# Altium project UWB-IQ-Mixer.PrjPcb
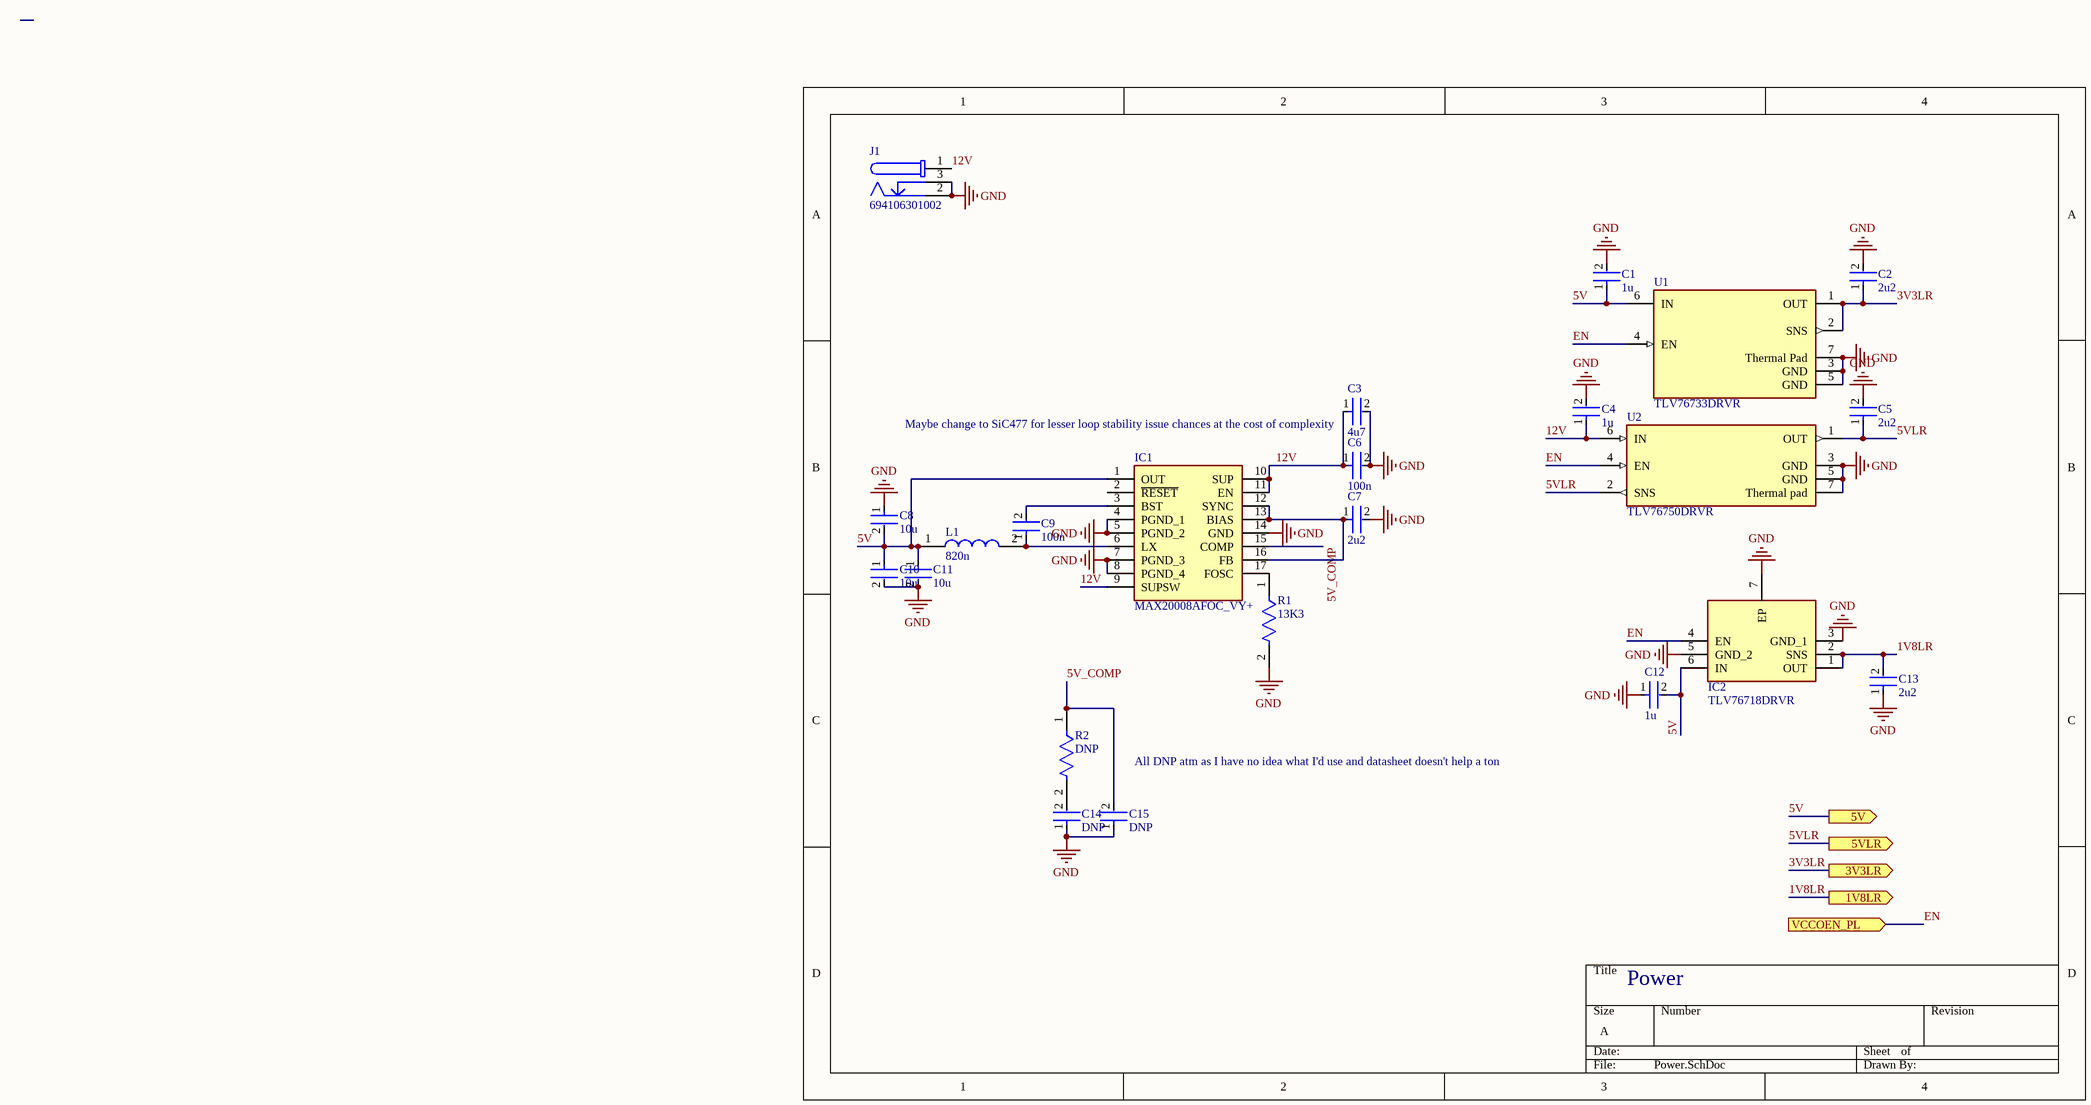
[diagram p0: Power.SchDoc]
9 sheets, 131 parts. Net scope: flat (ports and power ports of the same name join across sheets).
Board file: PCB.PcbDoc
Sheets:
  Power.SchDoc
  Mixers.SchDoc
  DACs.SchDoc
  PLL1.SchDoc
  PLL2.SchDoc
  SOM_AB.SchDoc
  SOM_CD.SchDoc
  Clock_Source.SchDoc
  Connectors.SchDoc

## Sheet Power.SchDoc
size A; SheetNumber: 1; SheetTotal: 9

### Parts
C1  1u  [FP-GRM155-0_1-MFG]
C2  2u2  [FP-GRM155-0_2-MFG]
C3  4u7  [FP-GRT188-0_2-IPC_A]
C4  1u  [FP-GRM155-0_1-MFG]
C5  2u2  [FP-GRM155-0_2-MFG]
C6  100n  [FP-GRM155-0_05-IPC_C]
C7  2u2  [FP-GRM155-0_2-MFG]
C8  10u  [FP-GRM188-0_2-IPC_B]
C9  100n  [FP-GRM155-0_05-IPC_C]
C10  10u  [FP-GRM188-0_2-IPC_B]
C11  10u  [FP-GRM188-0_2-IPC_B]
C12  1u  [FP-GRM155-0_1-MFG]
C13  2u2  [FP-GRM155-0_2-MFG]
C14  DNP  [FP-GRM155-0_05-IPC_C]  (no BOM)
C15  DNP  [FP-GRM155-0_05-IPC_C]  (no BOM)
IC1  MAX20008AFOC_VY+  [MAX20008AFOCVY]
IC2  TLV76718DRVR  [SON65P200X200X80-7N]
J1  694106301002  [694106301002]
L1  820n  [INDPM7166X300N]
R1  13K3  [FP-AC0402-IPC_B]
R2  DNP  [FP-AC0402-IPC_B]  (no BOM)
U1  TLV76733DRVR  [FP-DRV0006A-IPC_C]
U2  TLV76750DRVR  [FP-DRV0006A-IPC_B]

### Ports
1V8LR (out), 3V3LR (out), 5V (out), 5VLR (out), VCCOEN_PL (in)

### Nets
GND: C1.2 C2.2 C3.2 C4.2 C5.2 C6.2 C7.2 C8.1 C10.2 C11.2 C12.1 C13.1 C14.1 C15.1 IC1.4(PGND_1) IC1.5(PGND_2) IC1.7(PGND_3) IC1.8(PGND_4) IC1.14(GND) IC2.3(GND_1) IC2.5(GND_2) IC2.7(EP) J1.2 J1.3 R1.2 U1.3(GND) U1.5(GND) U1.7(Thermal_Pad) U2.3(GND) U2.5(GND) U2.7(Thermal_pad)  [project net PS0]
1V8LR: C13.2 IC2.1(OUT) IC2.2(SNS) ; port 1V8LR  [project net 1V8]
3V3LR: C2.1 U1.1(OUT) U1.2(SNS) ; port 3V3LR  [project net 3V3]
5V: C1.1 C8.2 C10.1 C11.1 C12.2 IC1.1(OUT) IC2.6(IN) L1.1 U1.6(IN) ; port 5V
5V_COMP: C15.2 IC1.15(COMP) R2.1
5VLR: C5.1 U2.1(OUT) U2.2(SNS) ; port 5VLR
12V: C3.1 C4.1 C6.1 IC1.9(SUPSW) IC1.10(SUP) IC1.11(EN) J1.1 U2.6(IN)
EN: IC2.4(EN) U1.4(EN) U2.4(EN) ; port VCCOEN_PL
NetC7_1: C7.1 IC1.12(SYNC) IC1.13(BIAS) IC1.16(FB)
NetC9_1: C9.1 IC1.6(LX) L1.2
NetC9_2: C9.2 IC1.3(BST)
NetC14_2: C14.2 R2.2
NetIC1_17: IC1.17(FOSC) R1.1

Not connected (* = marked no-connect by the designer): IC1 2(~{RESET})

### Notes on the sheet
- (near C3) Maybe change to SiC477 for lesser loop stability issue chances at the cost of complexity
- All DNP atm as I have no idea what I'd use and datasheet doesn't help a ton
- Power

### Library data of the parts
C1 C4 C12 = CMP-06035-041084-1: Chip Multilayer Ceramic Capacitors for General Purpose, 0402, 1.0uF, X5R, 15%, 10%, 50V
C2 C5 C7 C13 = CMP-06035-031599-1: Chip Multilayer Ceramic Capacitors for General Purpose, 0402, 2.2uF, X5R, 15%, 10%, 35V; Case/Package: 0402
C3 = CMP-06035-045585-1: Multi-Layer Ceramic Capacitor 4.7uF 35V X5R ±10% 0603 Paper T/R
C6 C9 C14 C15 = CMP-06035-008289-1: Chip Multilayer Ceramic Capacitors for General Purpose, 0402, 0.10uF, X5R, 15%, 10%, 100V; Capacitance: 100nF; Case Code (Metric): 1005; Width: 0.5mm; Case/Package: 0402; Case Code (Imperial): 0402; Voltage Rating (DC): 100V; Package Quantity: 10000; Length: 0.039inch; Height: 0.5mm; Max Operating Temperature: 85°C; Lead Free: Lead Free; Termination: SMD/SMT; Mount: Surface Mount; Tolerance: 10%; Packaging: Tape and Reel; Voltage Rating: 100V; Thickness: 0.022inch; Dielectric: X5R; REACH SVHC: No SVHC; Min Operating Temperature: -55°C; Weight: 0.000212oz
C8 C10 C11 = CMP-06035-022879-1: Chip Multilayer Ceramic Capacitors for General Purpose, 0603, 10uF, X5R, 15%, 10%, 25V
IC1 = MAX20008AFOC_VY+: Integrated Circuit; Manufacturer_Name: Analog Devices; Manufacturer_Part_Number: MAX20008AFOC/VY+; Datasheet Link: https://www.analog.com/media/en/technical-documentation/data-sheets/MAX20004-MAX20008.pdf; Height: 0.75mm; Mouser Part Number: 700-MAX20008AFOC/VY+; Mouser Price/Stock: https://www.mouser.co.uk/ProductDetail/Analog-Devices-Maxim-Integrated/MAX20008AFOC-VY%2b?qs=gZXFycFWdAPYYhB%2FcA8TDQ%3D%3D; Arrow Part Number: MAX20008AFOC/VY+; Arrow Price/Stock: https://www.arrow.com/en/products/max20008afocvy/maxim-integrated?region=nac
IC2 = TLV76718DRVR: Integrated Circuit; Manufacturer_Name: Texas Instruments; Datasheet Link: http://www.ti.com/lit/gpn/TLV767; Height: 0.8mm; Manufacturer_Part_Number: TLV76718DRVR; Mouser Part Number: 595-TLV76718DRVR; Mouser Price/Stock: https://www.mouser.co.uk/ProductDetail/Texas-Instruments/TLV76718DRVR?qs=9r4v7xj2Lnk9Dlu7qdid6g%3D%3D; Arrow Part Number: TLV76718DRVR; Arrow Price/Stock: https://www.arrow.com/en/products/tlv76718drvr/texas-instruments?region=nac
J1 = CMP-1502-00188-2: NexarPartId: 52676100; Voltage Rating (DC): 20V; Gender: Male; Voltage Rating: 24V; Connector Type: Power; Insulation Resistance: 100MΩ; Current Rating: 5A; Shielding: Unshielded; Number of Contacts: 3; Color: Black; Housing Material: Polyamide; Contact Gender: Female; REACH SVHC: Unknown; Termination: Through Hole; Height: 11mm; RoHS: Compliant; Mount: Through Hole; Flammability Rating: UL94 V-0; Packaging: Bulk; Min Operating Temperature: -40°C; Contact Plating: Tin; Max Operating Temperature: 85°C; Operating Supply Voltage: 24V; Contact Material: Gold, Tin
L1 = ECS-MPIL0630-R82MC: Inductor; Manufacturer_Name: ECS; Datasheet Link: https://www.arrow.com/en/products/ecs-mpil0630-r82mc/ecs-international; Height: 3mm; Manufacturer_Part_Number: ECS-MPIL0630-R82MC; Mouser Part Number: 520-MPIL0630-R82MC; Mouser Price/Stock: https://www.mouser.co.uk/ProductDetail/ECS/ECS-MPIL0630-R82MC?qs=wd5RIQLrsJhh%2FAGpWz2Oog%3D%3D; Arrow Part Number: ECS-MPIL0630-R82MC; Arrow Price/Stock: https://www.arrow.com/en/products/ecs-mpil0630-r82mc/ecs-international
R1 R2 = CMP-03412-003052-2: RES 13.3kΩ ±1% 0.063W 0402; Resistance: 13.3kR; Power Rating: 62.5mW; Max Power Dissipation: 63mW; Voltage Rating: 50V; Temperature Coefficient: 100ppm/°C; Series: AC; Width: 0.5mm; Number of Terminations: 2; Features: Moisture Resistant; Packaging: Tape and Reel; Case Code (Imperial): 0402; Resistor Type: Thick Film; Case/Package: 0402; Length: 0.039inch; RoHS Compliant: Yes; Tolerance: 1%; Case Code (Metric): 1005; Height: 0.015inch; Termination: SMD/SMT; Min Operating Temperature: -55°C; Max Operating Temperature: 155°C
U1 = CMP-04917-000203-1: VOLTAGE COMPARATOR
U2 = CMP-04917-000175-1: IC VREG LINEAR

## Sheet Mixers.SchDoc
size A; SheetNumber: 2; SheetTotal: 9
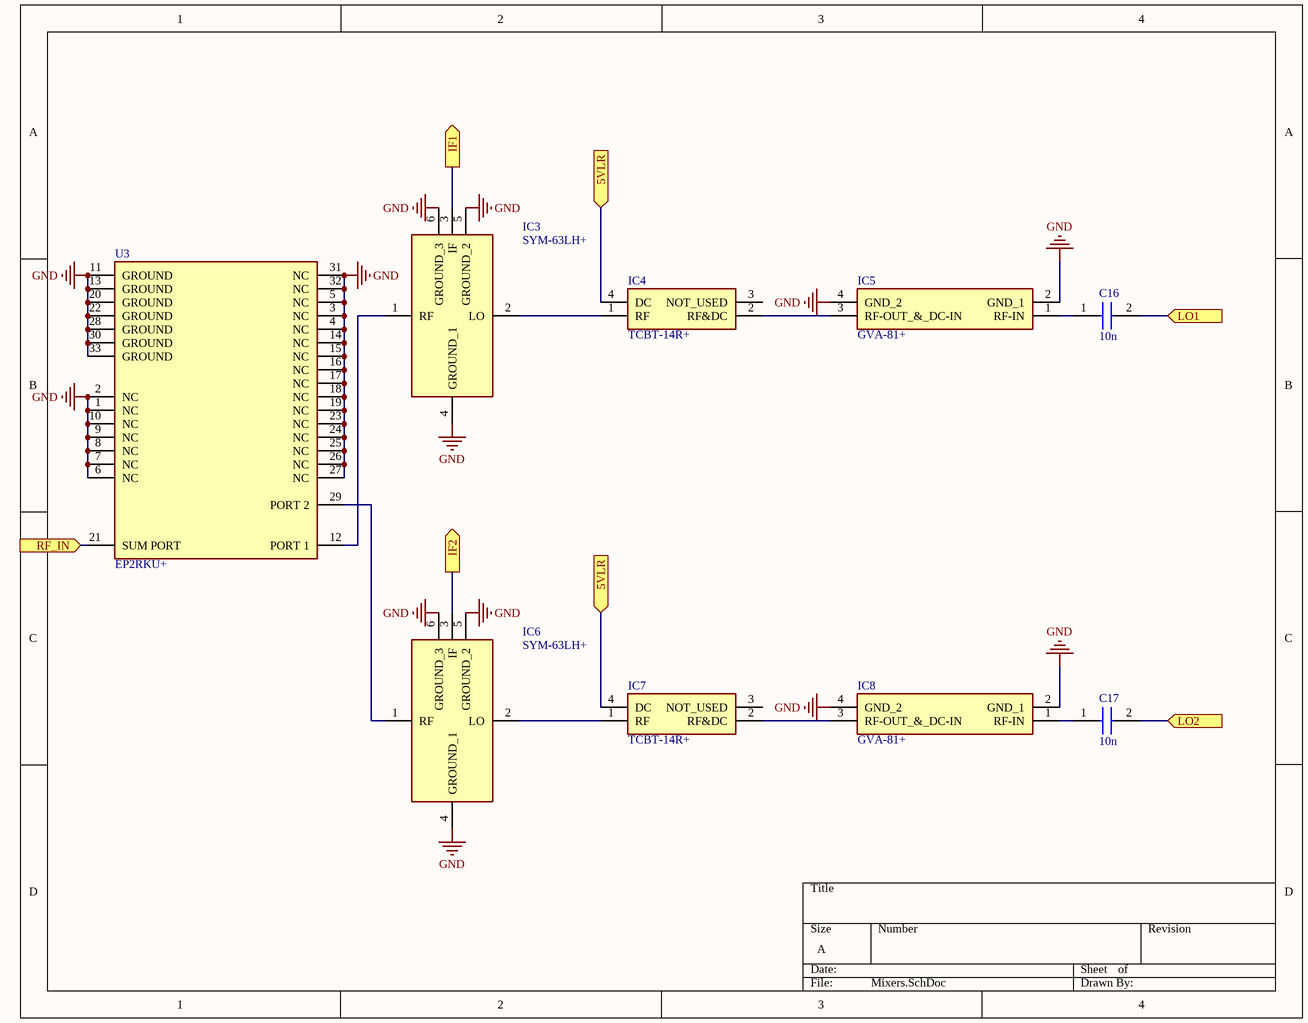
[diagram p1: Mixers.SchDoc]

### Parts
C16  10n  [CAPC1005X61N]
C17  10n  [CAPC1005X61N]
IC3  SYM-63LH+  [SYM63LH]
IC4  TCBT-14R+  [TCBT14R]
IC5  GVA-81+  [GVA63]
IC6  SYM-63LH+  [SYM63LH]
IC7  TCBT-14R+  [TCBT14R]
IC8  GVA-81+  [GVA63]
U3  EP2RKU+  [FP-EP2RKU+-MFG]

### Ports
5VLR (in), IF1 (out), IF2 (out), LO1 (in), LO2 (in), RF_IN (in)

### Nets
GND: IC3.4(GROUND_1) IC3.5(GROUND_2) IC3.6(GROUND_3) IC5.2(GND_1) IC5.4(GND_2) IC6.4(GROUND_1) IC6.5(GROUND_2) IC6.6(GROUND_3) IC8.2(GND_1) IC8.4(GND_2) U3.1(NC) U3.2(NC) U3.3(NC) U3.4(NC) U3.5(NC) U3.6(NC) U3.7(NC) U3.8(NC) U3.9(NC) U3.10(NC) U3.11(GROUND) U3.13(GROUND) U3.14(NC) U3.15(NC) U3.16(NC) U3.17(NC) U3.18(NC) U3.19(NC) U3.20(GROUND) U3.22(GROUND) U3.23(NC) U3.24(NC) U3.25(NC) U3.26(NC) U3.27(NC) U3.28(GROUND) U3.30(GROUND) U3.31(NC) U3.32(NC) U3.33(GROUND)  [project net PS0]
5VLR: IC4.4(DC) IC7.4(DC) ; port 5VLR
IF1: IC3.3(IF) ; port IF1
IF2: IC6.3(IF) ; port IF2
LO1: C16.2 ; port LO1
LO2: C17.2 ; port LO2
RF_IN: U3.21(SUM_PORT) ; port RF_IN
NetC16_1: C16.1 IC5.1(RF-IN)
NetC17_1: C17.1 IC8.1(RF-IN)
NetIC3_1: IC3.1(RF) U3.12(PORT_1)
NetIC3_2: IC3.2(LO) IC4.1(RF)
NetIC4_2: IC4.2(RF&DC) IC5.3(RF-OUT_&_DC-IN)
NetIC6_1: IC6.1(RF) U3.29(PORT_2)
NetIC6_2: IC6.2(LO) IC7.1(RF)
NetIC7_2: IC7.2(RF&DC) IC8.3(RF-OUT_&_DC-IN)

Not connected (* = marked no-connect by the designer): IC4 3(NOT_USED); IC7 3(NOT_USED)

### Library data of the parts
C16 C17 = 520L103KT16T: Capacitor; Manufacturer_Name: ATC / Kyocera AVX; Datasheet Link: https://rfs.kyocera-avx.com/userFiles/uploads/pdfs/520l.pdf; Height: 0.61mm; Manufacturer_Part_Number: 520L103KT16T; Mouser Part Number: 581-520L103KT16T; Mouser Price/Stock: https://www.mouser.co.uk/ProductDetail/ATC-KYOCERA-AVX/520L103KT16T?qs=1tb21EFCQjo0F0Wws%2FObWA%3D%3D
IC3 IC6 = SYM-63LH+: Integrated Circuit; Manufacturer_Name: Mini-Circuits; Datasheet Link: https://www.minicircuits.com/case_style/TTT166.pdf; Height: 3.82mm; Manufacturer_Part_Number: SYM-63LH+; Mouser Part Number: 139-SYM-63LH; Mouser Price/Stock: https://www.mouser.co.uk/ProductDetail/Mini-Circuits/SYM-63LH%2b?qs=xZ%2FP%252Ba9zWqZ%252BsdBVtVbUEA%3D%3D
IC4 IC7 = TCBT-14R+: Integrated Circuit; Manufacturer_Name: Mini-Circuits; Datasheet Link: https://www.minicircuits.com/pdfs/TCBT-14R+.pdf; Manufacturer_Part_Number: TCBT-14R+; Mouser Part Number: 139-TCBT-14R; Mouser Price/Stock: https://www.mouser.co.uk/ProductDetail/Mini-Circuits/TCBT-14R%2b?qs=xZ%2FP%252Ba9zWqaAUsoP1T4TSg%3D%3D
IC5 IC8 = GVA-81+: Integrated Circuit; Manufacturer_Name: Mini-Circuits; Datasheet Link: https://www.minicircuits.com/pdfs/GVA-81+.pdf; Height: 1mm; Manufacturer_Part_Number: GVA-81+; Mouser Part Number: 139-GVA-81; Mouser Price/Stock: https://www.mouser.co.uk/ProductDetail/Mini-Circuits/GVA-81%2b?qs=xZ%2FP%252Ba9zWqaubdVvazP9nQ%3D%3D
U3 = CMP-199890-000004-1: EP2RKU+ 2 Ways MMIC Power Splitter, DC - 18000 MHz, 50Ω

## Sheet DACs.SchDoc
size A; SheetNumber: 3; SheetTotal: 9
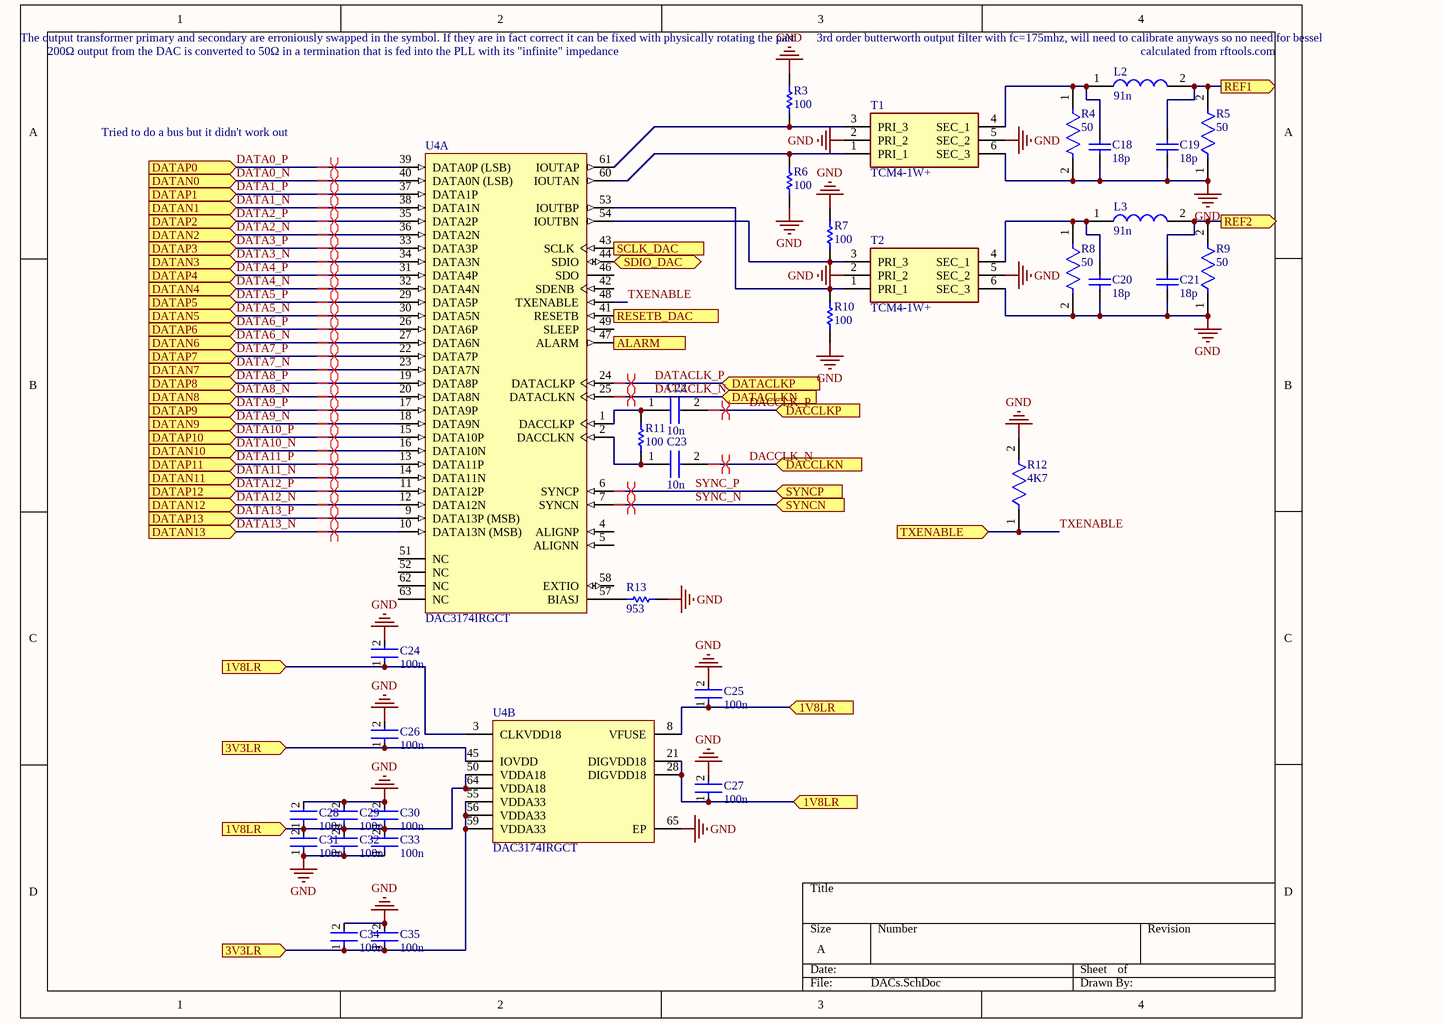
[diagram p2: DACs.SchDoc]

### Parts
C18  18p  [CAPC1006X50X20LL10T10]
C19  18p  [CAPC1006X50X20LL10T10]
C20  18p  [CAPC1006X50X20LL10T10]
C21  18p  [CAPC1006X50X20LL10T10]
C22  10n  [CAPC1005X61N]
C23  10n  [CAPC1005X61N]
C24  100n  [FP-GRM155-0_05-IPC_C]
C25  100n  [FP-GRM155-0_05-IPC_C]
C26  100n  [FP-GRM155-0_05-IPC_C]
C27  100n  [FP-GRM155-0_05-IPC_C]
C28  100n  [FP-GRM155-0_05-IPC_C]
C29  100n  [FP-GRM155-0_05-IPC_C]
C30  100n  [FP-GRM155-0_05-IPC_C]
C31  100n  [FP-GRM155-0_05-IPC_C]
C32  100n  [FP-GRM155-0_05-IPC_C]
C33  100n  [FP-GRM155-0_05-IPC_C]
C34  100n  [FP-GRM155-0_05-IPC_C]
C35  100n  [FP-GRM155-0_05-IPC_C]
L2  91n  [INDC1006X65N]
L3  91n  [INDC1006X65N]
R3  100  [RESC1005X40X25LL05T05]
R4  50  [FP-RC0402-0_4-MFG]
R5  50  [FP-RC0402-0_4-MFG]
R6  100  [RESC1005X40X25LL05T05]
R7  100  [RESC1005X40X25LL05T05]
R8  50  [FP-RC0402-0_4-MFG]
R9  50  [FP-RC0402-0_4-MFG]
R10  100  [RESC1005X40X25LL05T05]
R11  100  [RESC1005X40X25LL05T05]
R12  4K7  [FP-RT0402-MFG]
R13  953  [RESC1005X40X25NL10T10]
T1  TCM4-1W+  [TCM41W]
T2  TCM4-1W+  [TCM41W]
U4  DAC3174IRGCT  [TI-RGC64-7400X7400TP_V]  (parts A,B of 2)

### Ports
1V8LR (in), 3V3LR (in), ALARM (out), DACCLKN (in), DACCLKP (in), DATACLKN (in), DATACLKP (in), DATAN0 (in), DATAN1 (in), DATAN2 (in), DATAN3 (in), DATAN4 (in), DATAN5 (in), DATAN6 (in), DATAN7 (in), DATAN8 (in), DATAN9 (in), DATAN10 (in), DATAN11 (in), DATAN12 (in), DATAN13 (in), DATAP0 (in), DATAP1 (in), DATAP2 (in), DATAP3 (in), DATAP4 (in), DATAP5 (in), DATAP6 (in), DATAP7 (in), DATAP8 (in), DATAP9 (in), DATAP10 (in), DATAP11 (in), DATAP12 (in), DATAP13 (in), REF1 (out), REF2 (out), RESETB_DAC (in), SCLK_DAC (in), SDIO_DAC (bidir), SYNCN (in), SYNCP (in), TXENABLE (in)

### Nets
GND: C18.1 C19.1 C20.1 C21.1 C24.2 C25.2 C26.2 C27.2 C28.2 C29.2 C30.2 C31.1 C32.1 C33.1 C34.2 C35.2 R3.2 R4.2 R5.1 R6.1 R7.2 R8.2 R9.1 R10.1 R12.2 R13.2 T1.2(PRI_2) T1.5(SEC_2) T1.6(SEC_3) T2.2(PRI_2) T2.5(SEC_2) T2.6(SEC_3) U4.65(EP)  [project net PS0]
1V8: C24.1 C25.1 C27.1 C28.1 C29.1 C30.1 C31.2 C32.2 C33.2 U4.3(CLKVDD18) U4.8(VFUSE) U4.21(DIGVDD18) U4.28(DIGVDD18) U4.50(VDDA18) U4.64(VDDA18) ; port 1V8LR
3V3: C26.1 C34.1 C35.1 U4.45(IOVDD) U4.55(VDDA33) U4.56(VDDA33) U4.59(VDDA33) ; port 3V3LR
ALARM: U4.47(ALARM) ; port ALARM
DACCLK_N: C23.2 ; port DACCLKN
DACCLK_P: C22.2 ; port DACCLKP
DATA0_N: U4.40(DATA0N_(LSB)) ; port DATAN0
DATA0_P: U4.39(DATA0P_(LSB)) ; port DATAP0
DATA1_N: U4.38(DATA1N) ; port DATAN1
DATA1_P: U4.37(DATA1P) ; port DATAP1
DATA2_N: U4.36(DATA2N) ; port DATAN2
DATA2_P: U4.35(DATA2P) ; port DATAP2
DATA3_N: U4.34(DATA3N) ; port DATAN3
DATA3_P: U4.33(DATA3P) ; port DATAP3
DATA4_N: U4.32(DATA4N) ; port DATAN4
DATA4_P: U4.31(DATA4P) ; port DATAP4
DATA5_N: U4.30(DATA5N) ; port DATAN5
DATA5_P: U4.29(DATA5P) ; port DATAP5
DATA6_N: U4.27(DATA6N) ; port DATAN6
DATA6_P: U4.26(DATA6P) ; port DATAP6
DATA7_N: U4.23(DATA7N) ; port DATAN7
DATA7_P: U4.22(DATA7P) ; port DATAP7
DATA8_N: U4.20(DATA8N) ; port DATAN8
DATA8_P: U4.19(DATA8P) ; port DATAP8
DATA9_N: U4.18(DATA9N) ; port DATAN9
DATA9_P: U4.17(DATA9P) ; port DATAP9
DATA10_N: U4.16(DATA10N) ; port DATAN10
DATA10_P: U4.15(DATA10P) ; port DATAP10
DATA11_N: U4.14(DATA11N) ; port DATAN11
DATA11_P: U4.13(DATA11P) ; port DATAP11
DATA12_N: U4.12(DATA12N) ; port DATAN12
DATA12_P: U4.11(DATA12P) ; port DATAP12
DATA13_N: U4.10(DATA13N_(MSB)) ; port DATAN13
DATA13_P: U4.9(DATA13P_(MSB)) ; port DATAP13
DATACLK_N: U4.25(DATACLKN) ; port DATACLKN
DATACLK_P: U4.24(DATACLKP) ; port DATACLKP
REF1: C19.2 L2.2 R5.2 ; port REF1
REF2: C21.2 L3.2 R9.2 ; port REF2
RESETB_DAC: U4.41(RESETB) ; port RESETB_DAC
SCLK_DAC: U4.43(SCLK) ; port SCLK_DAC
SDIO_DAC: U4.44(SDIO) ; port SDIO_DAC
SYNC_N: U4.7(SYNCN) ; port SYNCN
SYNC_P: U4.6(SYNCP) ; port SYNCP
TXENABLE: R12.1 U4.48(TXENABLE) ; port TXENABLE
NetC18_2: C18.2 L2.1 R4.1 T1.4(SEC_1)
NetC20_2: C20.2 L3.1 R8.1 T2.4(SEC_1)
NetC22_1: C22.1 R11.2 U4.1(DACCLKP)
NetC23_1: C23.1 R11.1 U4.2(DACCLKN)
NetR3_1: R3.1 T1.3(PRI_3) U4.61(IOUTAP)
NetR6_2: R6.2 T1.1(PRI_1) U4.60(IOUTAN)
NetR7_1: R7.1 T2.3(PRI_3) U4.54(IOUTBN)
NetR10_2: R10.2 T2.1(PRI_1) U4.53(IOUTBP)
NetR13_1: R13.1 U4.57(BIASJ)

Not connected (* = marked no-connect by the designer): U4 4(ALIGNP) 5(ALIGNN) 42(SDENB) 46(SDO) 49(SLEEP) 51(NC) 52(NC) 58(EXTIO) 62(NC) 63(NC)

### Layout directives
differential pair: DACCLK_N, DACCLK_P, DATA0_N, DATA0_P, DATA1_N, DATA1_P, DATA2_N, DATA2_P, DATA3_N, DATA3_P, DATA4_N, DATA4_P, DATA5_N, DATA5_P, DATA6_N, DATA6_P, DATA7_N, DATA7_P, DATA8_N, DATA8_P, DATA9_N, DATA9_P, DATA10_N, DATA10_P, DATA11_N, DATA11_P, DATA12_N, DATA12_P, DATA13_N, DATA13_P, DATACLK_N, DATACLK_P, SYNC_N, SYNC_P

### Notes on the sheet
- (near R3) The output transformer primary and secondary are erroniously swapped in the symbol. If they are in fact correct it can be fixed with physically rotating the part
- (near R3) 200Ω output from the DAC is converted to 50Ω in a termination that is fed into the PLL with its "infinite" impedance
- 3rd order butterworth output filter with fc=175mhz, will need to calibrate anyways so no need for bessel
- (near L2) calculated from rftools.com
- Tried to do a bus but it didn't work out

### Library data of the parts
C18-C21 = CMP-2008-04828-1: Manufacturer: AVX Interconnect / Elco; Part Number: 04023K180FBSTR
C22 C23 = 520L103KT16T: as C16 on sheet Mixers; Datasheet Link: https://rfs.kyocera-avx.com/userFiles/uploads/pdfs/520l.pdf; Height: 0.61mm; Manufacturer_Part_Number: 520L103KT16T; Mouser Part Number: 581-520L103KT16T; Mouser Price/Stock: https://www.mouser.co.uk/ProductDetail/ATC-KYOCERA-AVX/520L103KT16T?qs=1tb21EFCQjo0F0Wws%2FObWA%3D%3D
C24-C35 = CMP-06035-008289-1: as C6 on sheet Power; Case Code (Metric): 1005; Width: 0.5mm; Case/Package: 0402; Case Code (Imperial): 0402; Voltage Rating (DC): 100V; Package Quantity: 10000; Length: 0.039inch; Height: 0.5mm; Max Operating Temperature: 85°C; Lead Free: Lead Free; Termination: SMD/SMT; Mount: Surface Mount; Tolerance: 10%; Packaging: Tape and Reel; Voltage Rating: 100V; Thickness: 0.022inch; Dielectric: X5R; REACH SVHC: No SVHC; Min Operating Temperature: -55°C; Weight: 0.000212oz
L2 L3 = MLJ1005HXG91NJTD0B: Inductor; Manufacturer_Name: TDK; Datasheet Link: https://product.tdk.com/system/files/dam/doc/product/inductor/inductor/smd/catalog/inductor_commercial_standard_mlj1005h_en.pdf; Height: 0.65mm; Manufacturer_Part_Number: MLJ1005HXG91NJTD0B; Mouser Part Number: 810-MLJ1005HXG91NJTD; Mouser Price/Stock: https://www.mouser.co.uk/ProductDetail/TDK/MLJ1005HXG91NJTD0B?qs=TEkyp6rseslSN03swWUATw%3D%3D
R3 R6 R7 R10 R11 = CMP-2002-00605-3: Chip Resistor, 100 Ohm, +/- 1%, 100 mW, -55 to 155 degC, 0402 (1005 Metric), RoHS, Tape and Reel; Manufacturer: Basic Passives; PartNumber: ERJ-2RKF1000X; Power Rating: 100 mW; Resistance: 100 Ohm; Voltage Rating: 50 V; Case\/Package: 0402; Width: 0.5 mm; Pins: 2; ComponentLink2Description: Datasheet; PackageReference: 0402; Height: 0.35 mm; Tolerance: 1%; DatasheetVersion: 04/2015; Case Code (Imperial): 0402; Min Operating Temperature: -55 degC; Radiation Hardening: No; Length: 1 mm; Package Quantity: 10000; PackageDescription: 2-Pin Surface Mount Device, Body 1 x 0.5 mm; Mounting Technology: Surface Mount; Case Code (Metric): 1005; Packaging: Tape and Reel; ComponentLink1URL: http://www.panasonic.com/; RoHSCompliant: true; Max Operating Temperature: 155 degC; REACH SVHC: Yes; ComponentLink1Description: Manufacturer URL; ComponentLink2URL: http://industrial.panasonic.com/cdbs/www-data/pdf/RDA0000/AOA0000C86.pdf; Mount: Surface Mount
R4 R5 R8 R9 = CMP-00621-24490980-1: RC0402JR-0750RL SMD Chip Resistor, 50 Ohm, ± 5%, 63 mW, 0402 [1005 Metric], Thick Film, General Purpose; Temperature Coefficient: 100ppm/°C; Max Power Dissipation: 63mW; Resistance: 50Ω; Width: 508µm; RoHS: Compliant; Height: 406.4µm; Length: 990.6µm; Features: Moisture Resistant; Tolerance: 5%; Lead Free: Lead Free; Case/Package: 0402; NexarPartId: 24490980; Min Operating Temperature: -55°C; Composition: Thick Film; Packaging: Tape & Reel (TR); Schedule B: 8533210045, 8533210045; Number of Terminations: 2; Max Operating Temperature: 155°C
R12 = CMP-2002-02901-2: RES 4.70K OHM 1/16W 1% SMD 0402; Manufacturer Part Number: RT0402FRE074K7L; Manufacturer: Yageo; Voltage Rating: 50V; Temperature Coefficient: 50 ppm/°C; Value: 4.7KΩ; Tolerance: 0.01; Power Rating: 0.063W; ComponentLink2URL: http://www.yageo.com/documents/recent/PYu-RT_1-to-0.01_RoHS_L_9.pdf; Temperature Range High: +155°C; Mouser Description: Res Thin Film 0402 4.7K Ohm 1% 1/16W ±50ppm/°C SMD Paper T/R; Temperature Range Low: -55°C; Device Class L1: Passive Components; Lead Free: Yes; Series: RT; Resistance: 4.7KΩ; Automotive: No; Package: RT0402; Composition: Thin Film; RoHS: TRUE; ComponentLink2Description: Datasheet; Octopart: https://octopart.com/rt0402fre074k7l-yageo-1371922; Footprint Url: http://www.yageo.com/exep/pages/download/literatures/PYu-R_Mount_10.pdf; Height: 0.35mm; Category: Res; Device Class L3: Chip SMD Resistors; Temperature: -55°C to +155°C; Digikey Description: RES 4.70K OHM 1/16W 1% SMD 0402; Device Class L2: Resistors; Ipc Land Pattern Name: RESC10050X30
R13 = CMP-2002-04560-1: Manufacturer: KOA Speer; Part Number: RK73H1ETTP9530F
T1 T2 = TCM4-1W+: Transformer; Manufacturer_Name: Mini-Circuits; Datasheet Link: https://www.google.com/url?sa=t&rct=j&q=&esrc=s&source=web&cd=&cad=rja&uact=8&ved=2ahUKEwjm_aG0-oz0AhXN4IUKHUrwB4sQFnoECAMQAQ&url=https%3A%2F%2Fwww.minicircuits.com%2Fpdfs%2FTCM4-1W%2B.pdf&usg=AOvVaw11XL23IYKjB1UFdAKYtPlM; Height: 4.06mm; Manufacturer_Part_Number: TCM4-1W+; Mouser Part Number: 139-TCM4-1W; Mouser Price/Stock: https://www.mouser.co.uk/ProductDetail/Mini-Circuits/TCM4-1W%2b?qs=xZ%2FP%252Ba9zWqbIpovo64xO5Q%3D%3D
U4 = CMP-0004-01406-1: Dual 14-Bit 500 MSPS Digital to Analog Converter, -40 to 85 degC, 64-pin QFN (RGC64), Green (RoHS & no Sb/Br); Manufacturer: Texas Instruments; Power Consumption(Typ)(mW): 464; Resolution(Bits): 14; Settling Time(us): 0.011; SubFamily: High Speed DAC (>10MSPS); Packing: SMALL T&R; DAC Channels: 2; SFDR(dB): 82; DatasheetVersion: SLAS837A; ComponentLink3Description: Package Specification; ComponentLink1Description: Manufacturer URL; PackageDescription: 64-Pin Plastic Quad Flatpack No-Lead, Body 9 x 9 mm, Pitch 0.5 mm; Mounting Technology: Surface Mount; ComponentLink2URL: http://www.ti.com/lit/ds/symlink/dac3174.pdf; PackageReference: RGC64-7400X7400TP; PartNumber: DAC3174IRGCT; ComponentLink3URL: http://www.ti.com/litv/pdf/mpqf125e; ComponentLink2Description: Datasheet; Eco-Plan: Green (RoHS & no Sb/Br); PackageVersion: 4204106/F, 11/2011; ComponentLink1URL: http://www.ti.com/

## Sheet PLL1.SchDoc
size A; SheetNumber: 4; SheetTotal: 9
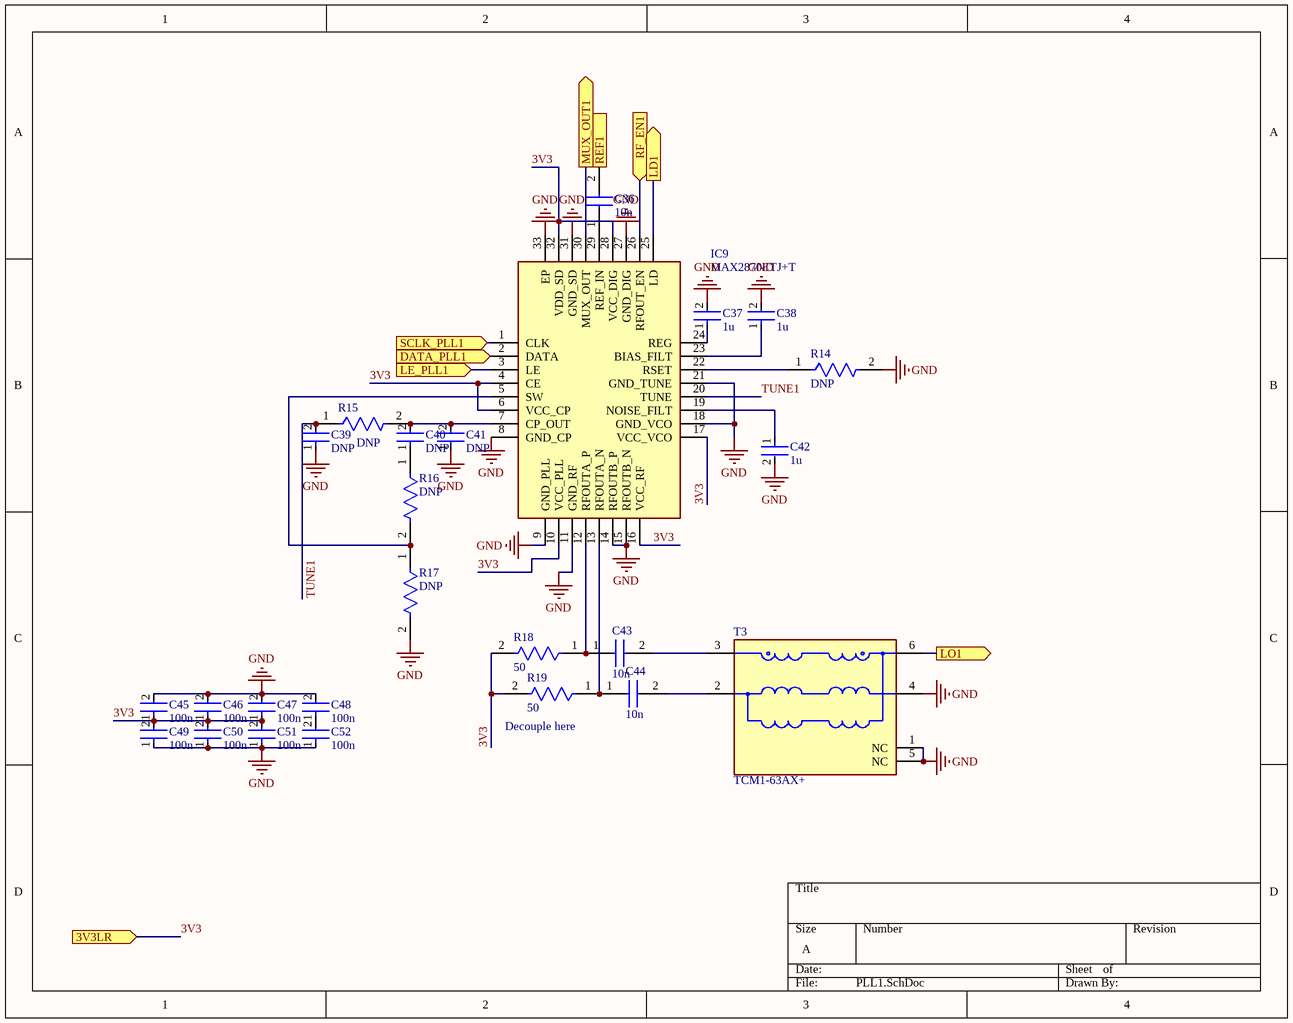
[diagram p3: PLL1.SchDoc]

### Parts
C36  10n  [CAPC1005X61N]
C37  1u  [FP-GRM155-0_1-MFG]
C38  1u  [FP-GRM155-0_1-MFG]
C39  DNP  [FP-GRM155-0_05-IPC_C]  (no BOM)
C40  DNP  [FP-GRM155-0_05-IPC_C]  (no BOM)
C41  DNP  [FP-GRM155-0_05-IPC_C]  (no BOM)
C42  1u  [FP-GRM155-0_1-MFG]
C43  10n  [CAPC1005X61N]
C44  10n  [CAPC1005X61N]
C45  100n  [FP-GRM155-0_05-IPC_C]
C46  100n  [FP-GRM155-0_05-IPC_C]
C47  100n  [FP-GRM155-0_05-IPC_C]
C48  100n  [FP-GRM155-0_05-IPC_C]
C49  100n  [FP-GRM155-0_05-IPC_C]
C50  100n  [FP-GRM155-0_05-IPC_C]
C51  100n  [FP-GRM155-0_05-IPC_C]
C52  100n  [FP-GRM155-0_05-IPC_C]
IC9  MAX2870ETJ+T  [QFN50P500X500X80-33N]
R14  DNP  [FP-AC0402-IPC_B]  (no BOM)
R15  DNP  [FP-AC0402-IPC_B]  (no BOM)
R16  DNP  [FP-AC0402-IPC_B]  (no BOM)
R17  DNP  [FP-AC0402-IPC_B]  (no BOM)
R18  50  [FP-RC0402-0_4-MFG]
R19  50  [FP-RC0402-0_4-MFG]
T3  TCM1-63AX+  [FP-TCM1-63AX+-MFG]

### Ports
3V3LR (in), DATA_PLL1 (in), LD1 (out), LE_PLL1 (in), LO1 (out), MUX_OUT1 (out), REF1 (in), RF_EN1 (in), SCLK_PLL1 (in)

### Nets
GND: C37.2 C38.2 C39.1 C41.1 C42.2 C45.2 C46.2 C47.2 C48.2 C49.1 C50.1 C51.1 C52.1 IC9.8(GND_CP) IC9.9(GND_PLL) IC9.11(GND_RF) IC9.14(RFOUTB_P) IC9.15(RFOUTB_N) IC9.18(GND_VCO) IC9.21(GND_TUNE) IC9.27(GND_DIG) IC9.31(GND_SD) IC9.33(EP) R14.2 R17.2 T3.1(NC) T3.4(SECONDARY) T3.5(NC)  [project net PS0]
3V3: C45.1 C46.1 C47.1 C49.2 C50.2 C51.2 IC9.4(CE) IC9.6(VCC_CP) IC9.10(VCC_PLL) IC9.16(VCC_RF) IC9.17(VCC_VCO) IC9.28(VCC_DIG) IC9.32(VDD_SD) R18.2 R19.2 ; port 3V3LR
DATA_PLL1: IC9.2(DATA) ; port DATA_PLL1
LD1: IC9.25(LD) ; port LD1
LE_PLL1: IC9.3(LE) ; port LE_PLL1
LO1: T3.6(SECONDARY_DOT) ; port LO1
MUX_OUT1: IC9.30(MUX_OUT) ; port MUX_OUT1
REF1: C36.2 ; port REF1
RF_EN1: IC9.26(RFOUT_EN) ; port RF_EN1
SCLK_PLL1: IC9.1(CLK) ; port SCLK_PLL1
TUNE1: C39.2 IC9.20(TUNE) R15.1
NetC36_1: C36.1 IC9.29(REF_IN)
NetC37_1: C37.1 IC9.24(REG)
NetC38_1: C38.1 IC9.23(BIAS_FILT)
NetC40_1: C40.1 R16.1
NetC40_2: C40.2 C41.2 IC9.7(CP_OUT) R15.2
NetC42_1: C42.1 IC9.19(NOISE_FILT)
NetC43_1: C43.1 IC9.12(RFOUTA_P) R18.1
NetC43_2: C43.2 T3.3(PRIMARY_DOT)
NetC44_1: C44.1 IC9.13(RFOUTA_N) R19.1
NetC44_2: C44.2 T3.2(GND)
NetC48_1: C48.1 C52.2
NetIC9_5: IC9.5(SW) R16.2 R17.1
NetIC9_22: IC9.22(RSET) R14.1

### Notes on the sheet
- (near R19) Decouple here

### Library data of the parts
C36 C43 C44 = 520L103KT16T: as C16 on sheet Mixers; Datasheet Link: https://rfs.kyocera-avx.com/userFiles/uploads/pdfs/520l.pdf; Height: 0.61mm; Manufacturer_Part_Number: 520L103KT16T; Mouser Part Number: 581-520L103KT16T; Mouser Price/Stock: https://www.mouser.co.uk/ProductDetail/ATC-KYOCERA-AVX/520L103KT16T?qs=1tb21EFCQjo0F0Wws%2FObWA%3D%3D
C37 C38 C42 = CMP-06035-041084-1: as C1 on sheet Power
C39-C41 C45-C52 = CMP-06035-008289-1: as C6 on sheet Power; Case Code (Metric): 1005; Width: 0.5mm; Case/Package: 0402; Case Code (Imperial): 0402; Voltage Rating (DC): 100V; Package Quantity: 10000; Length: 0.039inch; Height: 0.5mm; Max Operating Temperature: 85°C; Lead Free: Lead Free; Termination: SMD/SMT; Mount: Surface Mount; Tolerance: 10%; Packaging: Tape and Reel; Voltage Rating: 100V; Thickness: 0.022inch; Dielectric: X5R; REACH SVHC: No SVHC; Min Operating Temperature: -55°C; Weight: 0.000212oz
IC9 = MAX2870ETJ+T: Integrated Circuit; Manufacturer_Name: Analog Devices; Datasheet Link: https://datasheets.maximintegrated.com/en/ds/MAX2870.pdf; Height: 0.8mm; Manufacturer_Part_Number: MAX2870ETJ+T; Mouser Part Number: 700-MAX2870ETJ+T; Mouser Price/Stock: https://www.mouser.co.uk/ProductDetail/Analog-Devices-Maxim-Integrated/MAX2870ETJ%2bT?qs=UFD7vfw3J8rIUAsp8guXHg%3D%3D; Arrow Part Number: MAX2870ETJ+T; Arrow Price/Stock: https://www.arrow.com/en/products/max2870etjt/maxim-integrated?region=nac
R14-R17 = CMP-03412-003052-2: as R1 on sheet Power; Series: AC; Width: 0.5mm; Number of Terminations: 2; Features: Moisture Resistant; Packaging: Tape and Reel; Case Code (Imperial): 0402; Resistor Type: Thick Film; Case/Package: 0402; Length: 0.039inch; RoHS Compliant: Yes; Tolerance: 1%; Case Code (Metric): 1005; Height: 0.015inch; Termination: SMD/SMT; Min Operating Temperature: -55°C; Max Operating Temperature: 155°C
R18 R19 = CMP-00621-24490980-1: as R4 on sheet DACs; Width: 508µm; RoHS: Compliant; Height: 406.4µm; Length: 990.6µm; Features: Moisture Resistant; Tolerance: 5%; Lead Free: Lead Free; Case/Package: 0402; NexarPartId: 24490980; Min Operating Temperature: -55°C; Composition: Thick Film; Packaging: Tape & Reel (TR); Schedule B: 8533210045, 8533210045; Number of Terminations: 2; Max Operating Temperature: 155°C
T3 = CMP-199822-000001-1: 1:1 CORE & WIRE Transformer, 10 - 6000 MHz, 50Ω; Manufacturer: Mini-Circuits; Insertion Loss: 1.16-1.8dB; Return Loss: 9.42-16.9dB; Lead Free: Yes; Device Class L3: unset; Temperature: -40°C to +85°C; Manufacturer Part Number: TCM1-63AX+; Frequency: 10-6000MHz; Device Class L2: Transformers; RoHS: TRUE; Octopart: https://octopart.com/tcm1-63ax%2B-mini-circuits-107315723; Temperature Range Low: -40°C; Category: Trans; Package: 0; ComponentLink2URL: https://www.minicircuits.com/pdfs/TCM1-63AX+.pdf; ComponentLink2Description: Datasheet; Automotive: No; Height: 4.06mm; Device Class L1: Passive Components; Temperature Range High: +85°C; Turns Ratio: 1:1

## Sheet PLL2.SchDoc
size A; SheetNumber: 5; SheetTotal: 9
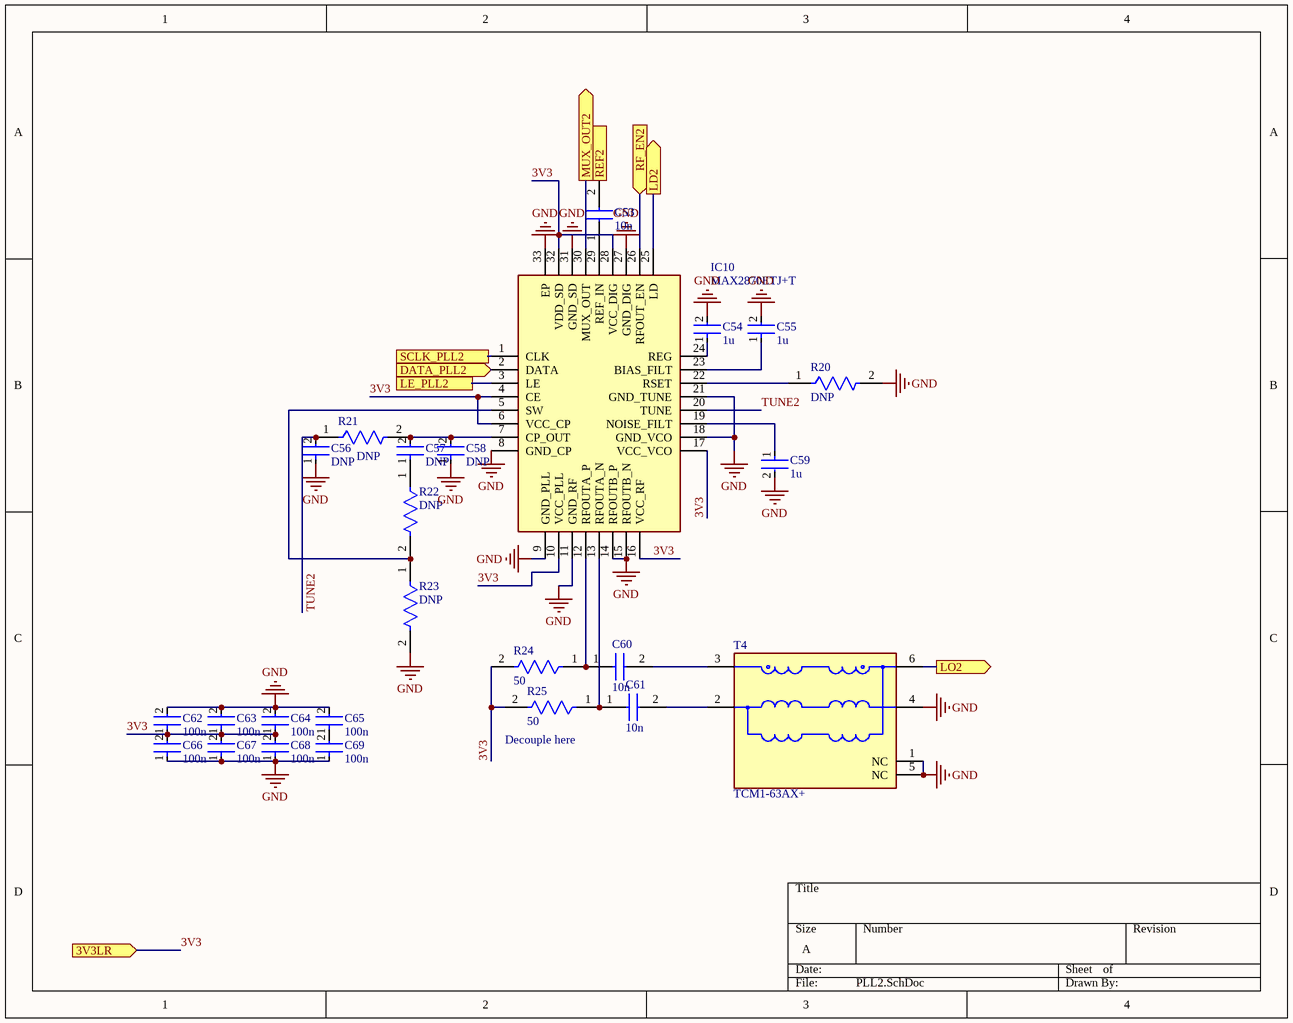
[diagram p4: PLL2.SchDoc]

### Parts
C53  10n  [CAPC1005X61N]
C54  1u  [FP-GRM155-0_1-MFG]
C55  1u  [FP-GRM155-0_1-MFG]
C56  DNP  [FP-GRM155-0_05-IPC_C]  (no BOM)
C57  DNP  [FP-GRM155-0_05-IPC_C]  (no BOM)
C58  DNP  [FP-GRM155-0_05-IPC_C]  (no BOM)
C59  1u  [FP-GRM155-0_1-MFG]
C60  10n  [CAPC1005X61N]
C61  10n  [CAPC1005X61N]
C62  100n  [FP-GRM155-0_05-IPC_C]
C63  100n  [FP-GRM155-0_05-IPC_C]
C64  100n  [FP-GRM155-0_05-IPC_C]
C65  100n  [FP-GRM155-0_05-IPC_C]
C66  100n  [FP-GRM155-0_05-IPC_C]
C67  100n  [FP-GRM155-0_05-IPC_C]
C68  100n  [FP-GRM155-0_05-IPC_C]
C69  100n  [FP-GRM155-0_05-IPC_C]
IC10  MAX2870ETJ+T  [QFN50P500X500X80-33N]
R20  DNP  [FP-AC0402-IPC_B]  (no BOM)
R21  DNP  [FP-AC0402-IPC_B]  (no BOM)
R22  DNP  [FP-AC0402-IPC_B]  (no BOM)
R23  DNP  [FP-AC0402-IPC_B]  (no BOM)
R24  50  [FP-RC0402-0_4-MFG]
R25  50  [FP-RC0402-0_4-MFG]
T4  TCM1-63AX+  [FP-TCM1-63AX+-MFG]

### Ports
3V3LR (in), DATA_PLL2 (in), LD2 (out), LE_PLL2 (in), LO2 (out), MUX_OUT2 (out), REF2 (in), RF_EN2 (in), SCLK_PLL2 (in)

### Nets
GND: C54.2 C55.2 C56.1 C58.1 C59.2 C62.2 C63.2 C64.2 C65.2 C66.1 C67.1 C68.1 C69.1 IC10.8(GND_CP) IC10.9(GND_PLL) IC10.11(GND_RF) IC10.14(RFOUTB_P) IC10.15(RFOUTB_N) IC10.18(GND_VCO) IC10.21(GND_TUNE) IC10.27(GND_DIG) IC10.31(GND_SD) IC10.33(EP) R20.2 R23.2 T4.1(NC) T4.4(SECONDARY) T4.5(NC)  [project net PS0]
3V3: C62.1 C63.1 C64.1 C66.2 C67.2 C68.2 IC10.4(CE) IC10.6(VCC_CP) IC10.10(VCC_PLL) IC10.16(VCC_RF) IC10.17(VCC_VCO) IC10.28(VCC_DIG) IC10.32(VDD_SD) R24.2 R25.2 ; port 3V3LR
DATA_PLL2: IC10.2(DATA) ; port DATA_PLL2
LD2: IC10.25(LD) ; port LD2
LE_PLL2: IC10.3(LE) ; port LE_PLL2
LO2: T4.6(SECONDARY_DOT) ; port LO2
MUX_OUT2: IC10.30(MUX_OUT) ; port MUX_OUT2
REF2: C53.2 ; port REF2
RF_EN2: IC10.26(RFOUT_EN) ; port RF_EN2
SCLK_PLL2: IC10.1(CLK) ; port SCLK_PLL2
TUNE2: C56.2 IC10.20(TUNE) R21.1
NetC53_1: C53.1 IC10.29(REF_IN)
NetC54_1: C54.1 IC10.24(REG)
NetC55_1: C55.1 IC10.23(BIAS_FILT)
NetC57_1: C57.1 R22.1
NetC57_2: C57.2 C58.2 IC10.7(CP_OUT) R21.2
NetC59_1: C59.1 IC10.19(NOISE_FILT)
NetC60_1: C60.1 IC10.12(RFOUTA_P) R24.1
NetC60_2: C60.2 T4.3(PRIMARY_DOT)
NetC61_1: C61.1 IC10.13(RFOUTA_N) R25.1
NetC61_2: C61.2 T4.2(GND)
NetC65_1: C65.1 C69.2
NetIC10_5: IC10.5(SW) R22.2 R23.1
NetIC10_22: IC10.22(RSET) R20.1

### Notes on the sheet
- (near R25) Decouple here

### Library data of the parts
C53 C60 C61 = 520L103KT16T: as C16 on sheet Mixers; Datasheet Link: https://rfs.kyocera-avx.com/userFiles/uploads/pdfs/520l.pdf; Height: 0.61mm; Manufacturer_Part_Number: 520L103KT16T; Mouser Part Number: 581-520L103KT16T; Mouser Price/Stock: https://www.mouser.co.uk/ProductDetail/ATC-KYOCERA-AVX/520L103KT16T?qs=1tb21EFCQjo0F0Wws%2FObWA%3D%3D
C54 C55 C59 = CMP-06035-041084-1: as C1 on sheet Power
C56-C58 C62-C69 = CMP-06035-008289-1: as C6 on sheet Power; Case Code (Metric): 1005; Width: 0.5mm; Case/Package: 0402; Case Code (Imperial): 0402; Voltage Rating (DC): 100V; Package Quantity: 10000; Length: 0.039inch; Height: 0.5mm; Max Operating Temperature: 85°C; Lead Free: Lead Free; Termination: SMD/SMT; Mount: Surface Mount; Tolerance: 10%; Packaging: Tape and Reel; Voltage Rating: 100V; Thickness: 0.022inch; Dielectric: X5R; REACH SVHC: No SVHC; Min Operating Temperature: -55°C; Weight: 0.000212oz
IC10 = MAX2870ETJ+T: as IC9 on sheet PLL1; Datasheet Link: https://datasheets.maximintegrated.com/en/ds/MAX2870.pdf; Height: 0.8mm; Manufacturer_Part_Number: MAX2870ETJ+T; Mouser Part Number: 700-MAX2870ETJ+T; Mouser Price/Stock: https://www.mouser.co.uk/ProductDetail/Analog-Devices-Maxim-Integrated/MAX2870ETJ%2bT?qs=UFD7vfw3J8rIUAsp8guXHg%3D%3D; Arrow Part Number: MAX2870ETJ+T; Arrow Price/Stock: https://www.arrow.com/en/products/max2870etjt/maxim-integrated?region=nac
R20-R23 = CMP-03412-003052-2: as R1 on sheet Power; Series: AC; Width: 0.5mm; Number of Terminations: 2; Features: Moisture Resistant; Packaging: Tape and Reel; Case Code (Imperial): 0402; Resistor Type: Thick Film; Case/Package: 0402; Length: 0.039inch; RoHS Compliant: Yes; Tolerance: 1%; Case Code (Metric): 1005; Height: 0.015inch; Termination: SMD/SMT; Min Operating Temperature: -55°C; Max Operating Temperature: 155°C
R24 R25 = CMP-00621-24490980-1: as R4 on sheet DACs; Width: 508µm; RoHS: Compliant; Height: 406.4µm; Length: 990.6µm; Features: Moisture Resistant; Tolerance: 5%; Lead Free: Lead Free; Case/Package: 0402; NexarPartId: 24490980; Min Operating Temperature: -55°C; Composition: Thick Film; Packaging: Tape & Reel (TR); Schedule B: 8533210045, 8533210045; Number of Terminations: 2; Max Operating Temperature: 155°C
T4 = CMP-199822-000001-1: as T3 on sheet PLL1; Lead Free: Yes; Device Class L3: unset; Temperature: -40°C to +85°C; Manufacturer Part Number: TCM1-63AX+; Frequency: 10-6000MHz; Device Class L2: Transformers; RoHS: TRUE; Octopart: https://octopart.com/tcm1-63ax%2B-mini-circuits-107315723; Temperature Range Low: -40°C; Category: Trans; Package: 0; ComponentLink2URL: https://www.minicircuits.com/pdfs/TCM1-63AX+.pdf; ComponentLink2Description: Datasheet; Automotive: No; Height: 4.06mm; Device Class L1: Passive Components; Temperature Range High: +85°C; Turns Ratio: 1:1

## Sheet SOM_AB.SchDoc
size A; SheetNumber: 6; SheetTotal: 9
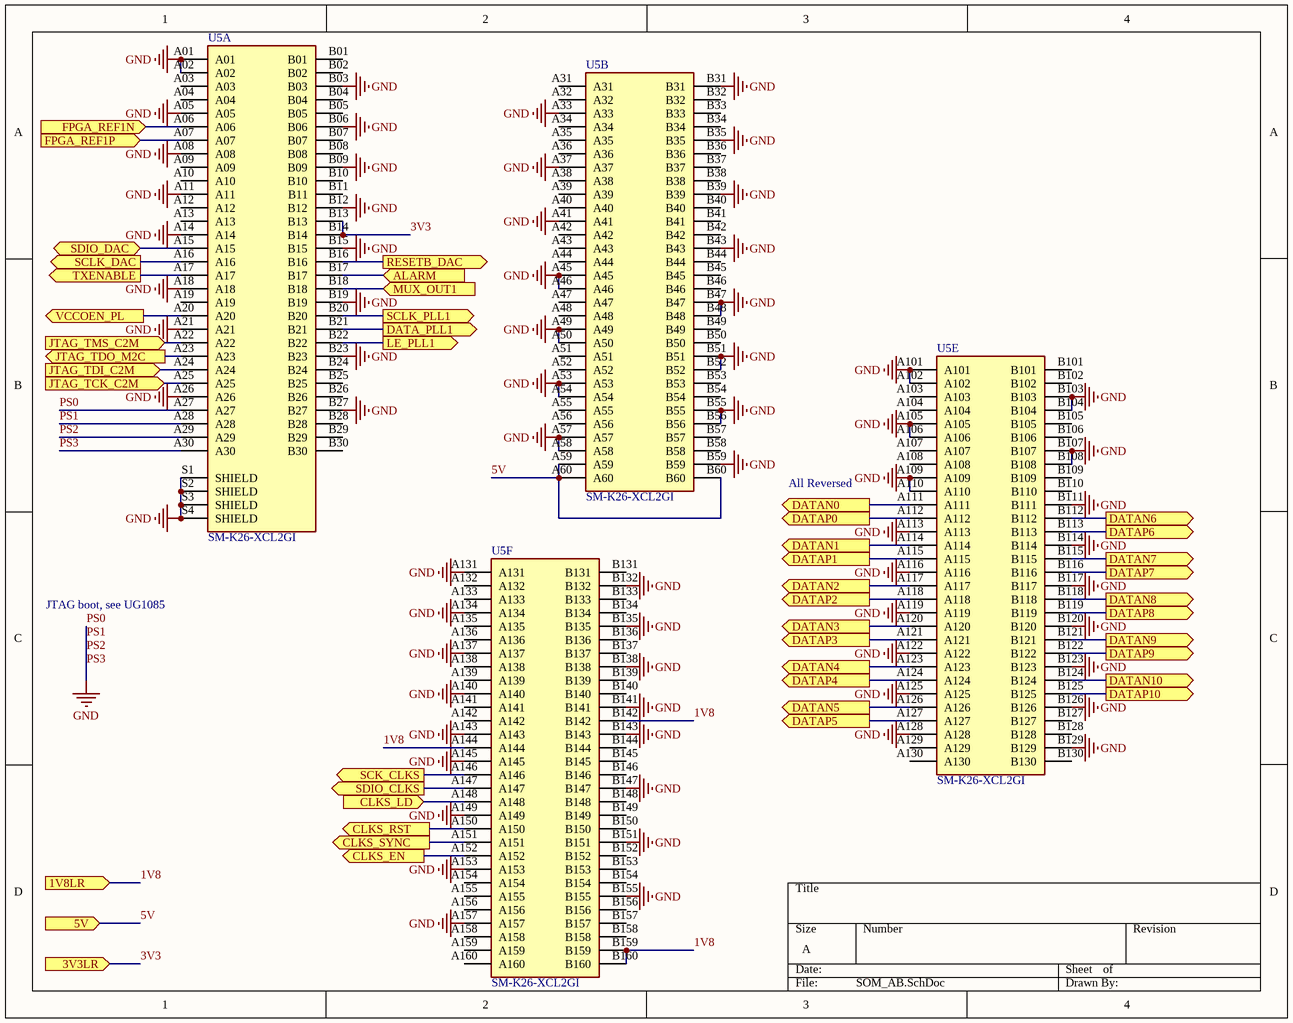
[diagram p5: SOM_AB.SchDoc]

### Parts
U5  SM-K26-XCL2GI  [MODULE_SM-K26-XCL2GI]  (parts A,B,E,F of 8)

### Ports
1V8LR (in), 3V3LR (in), 5V (in), ALARM (in), CLKS_EN (out), CLKS_LD (in), CLKS_RST (out), CLKS_SYNC (out), DATA_PLL1 (out), DATAN0 (out), DATAN1 (out), DATAN2 (out), DATAN3 (out), DATAN4 (out), DATAN5 (out), DATAN6 (out), DATAN7 (out), DATAN8 (out), DATAN9 (out), DATAN10 (out), DATAP0 (out), DATAP1 (out), DATAP2 (out), DATAP3 (out), DATAP4 (out), DATAP5 (out), DATAP6 (out), DATAP7 (out), DATAP8 (out), DATAP9 (out), DATAP10 (out), FPGA_REF1N (in), FPGA_REF1P (in), JTAG_TCK_C2M (in), JTAG_TDI_C2M (in), JTAG_TDO_M2C (out), JTAG_TMS_C2M (in), LE_PLL1 (out), MUX_OUT1 (in), RESETB_DAC (out), SCK_CLKS (out), SCLK_DAC (out), SCLK_PLL1 (out), SDIO_CLKS (out), SDIO_DAC (bidir), TXENABLE (out), VCCOEN_PL (out)

### Nets
PS0: U5.A01 U5.A02 U5.A05 U5.A08 U5.A11 U5.A14 U5.A18 U5.A21 U5.A26 U5.A27 U5.A28 U5.A29 U5.A30 U5.A33 U5.A37 U5.A41 U5.A45 U5.A46 U5.A49 U5.A50 U5.A53 U5.A54 U5.A57 U5.A58 U5.A101 U5.A102 U5.A105 U5.A106 U5.A109 U5.A110 U5.A113 U5.A116 U5.A119 U5.A122 U5.A125 U5.A128 U5.A131 U5.A134 U5.A137 U5.A140 U5.A143 U5.A145 U5.A149 U5.A153 U5.A157 U5.B03 U5.B06 U5.B09 U5.B12 U5.B15 U5.B19 U5.B23 U5.B27 U5.B31 U5.B35 U5.B39 U5.B43 U5.B47 U5.B48 U5.B51 U5.B52 U5.B55 U5.B56 U5.B59 U5.B103 U5.B104 U5.B107 U5.B108 U5.B111 U5.B114 U5.B117 U5.B120 U5.B123 U5.B126 U5.B129 U5.B132 U5.B135 U5.B138 U5.B141 U5.B143 U5.B147 U5.B151 U5.B155 U5.S1(SHIELD) U5.S2(SHIELD) U5.S3(SHIELD) U5.S4(SHIELD)  [also labelled GND, PS1, PS2, PS3]
1V8: U5.A144 U5.B142 U5.B159 U5.B160 ; port 1V8LR
3V3: U5.B13 U5.B14 ; port 3V3LR
5V: U5.A59 U5.A60 U5.B60 ; port 5V
ALARM: U5.B17 ; port ALARM
CLKS_EN: U5.A152 ; port CLKS_EN
CLKS_LD: U5.A148 ; port CLKS_LD
CLKS_RST: U5.A150 ; port CLKS_RST
CLKS_SYNC: U5.A151 ; port CLKS_SYNC
DATA0_N: U5.A111 ; port DATAN0
DATA0_P: U5.A112 ; port DATAP0
DATA1_N: U5.A114 ; port DATAN1
DATA1_P: U5.A115 ; port DATAP1
DATA2_N: U5.A117 ; port DATAN2
DATA2_P: U5.A118 ; port DATAP2
DATA3_N: U5.A120 ; port DATAN3
DATA3_P: U5.A121 ; port DATAP3
DATA4_N: U5.A123 ; port DATAN4
DATA4_P: U5.A124 ; port DATAP4
DATA5_N: U5.A126 ; port DATAN5
DATA5_P: U5.A127 ; port DATAP5
DATA6_N: U5.B112 ; port DATAN6
DATA6_P: U5.B113 ; port DATAP6
DATA7_N: U5.B115 ; port DATAN7
DATA7_P: U5.B116 ; port DATAP7
DATA8_N: U5.B118 ; port DATAN8
DATA8_P: U5.B119 ; port DATAP8
DATA9_N: U5.B121 ; port DATAN9
DATA9_P: U5.B122 ; port DATAP9
DATA10_N: U5.B124 ; port DATAN10
DATA10_P: U5.B125 ; port DATAP10
DATA_PLL1: U5.B21 ; port DATA_PLL1
EN: U5.A20 ; port VCCOEN_PL
JTAG_TCK_C2M: U5.A25 ; port JTAG_TCK_C2M
JTAG_TDI_C2M: U5.A24 ; port JTAG_TDI_C2M
JTAG_TDO_M2C: U5.A23 ; port JTAG_TDO_M2C
JTAG_TMS_C2M: U5.A22 ; port JTAG_TMS_C2M
LE_PLL1: U5.B22 ; port LE_PLL1
MUX_OUT1: U5.B18 ; port MUX_OUT1
REF1_N: U5.A06 ; port FPGA_REF1N
REF1_P: U5.A07 ; port FPGA_REF1P
RESETB_DAC: U5.B16 ; port RESETB_DAC
SCK_CLKS: U5.A146 ; port SCK_CLKS
SCLK_DAC: U5.A16 ; port SCLK_DAC
SCLK_PLL1: U5.B20 ; port SCLK_PLL1
SDIO_CLKS: U5.A147 ; port SDIO_CLKS
SDIO_DAC: U5.A15 ; port SDIO_DAC
TXENABLE: U5.A17 ; port TXENABLE

Not connected (* = marked no-connect by the designer): U5 A03 A04 A09 A10 A12 A13 A19 A31 A32 A34 A35 A36 A38 A39 A40 A42 A43 A44 A47 A48 A51 A52 A55 A56 A103 A104 A107 A108 A129 A130 A132 A133 A135 A136 A138 A139 A141 A142 A154 A155 A156 A158 A159 A160 B01 B02 B04 B05 B07 B08 B10 B11 B24 B25 B26 B28 B29 B30 B32 B33 B34 B36 B37 B38 B40 B41 B42 B44 B45 B46 B49 B50 B53 B54 B57 B58 B101 B102 B105 B106 B109 B110 B127 B128 B130 B131 B133 B134 B136 B137 B139 B140 B144 B145 B146 B148 B149 B150 B152 B153 B154 B156 B157 B158

### Notes on the sheet
- All Reversed
- JTAG boot, see UG1085

### Library data of the parts
U5 = SM-K26-XCL2GI: ZynqÂ® UltraScale+â„¢ Kriaâ„¢ Embedded Module ARMÂ® CortexÂ®-A53 ArmÂ® CortexÂ®-R5F 533MHz, 1.333GHz 4GB 16GB eMMC, 64MB QSPI; MF: Xilinx Inc.; Package: None; SnapEDA_Link: https://www.snapeda.com/parts/SM-K26-XCL2GI/Xilinx+Inc./view-part/?ref=snap; Value: *; MP: SM-K26-XCL2GI; Check_prices: https://www.snapeda.com/parts/SM-K26-XCL2GI/Xilinx+Inc./view-part/?ref=eda; Availability: In Stock; Price: None; Purchase-URL: https://pricing.snapeda.com/search/part/SM-K26-XCL2GI/?ref=eda

## Sheet SOM_CD.SchDoc
size A; SheetNumber: 7; SheetTotal: 9
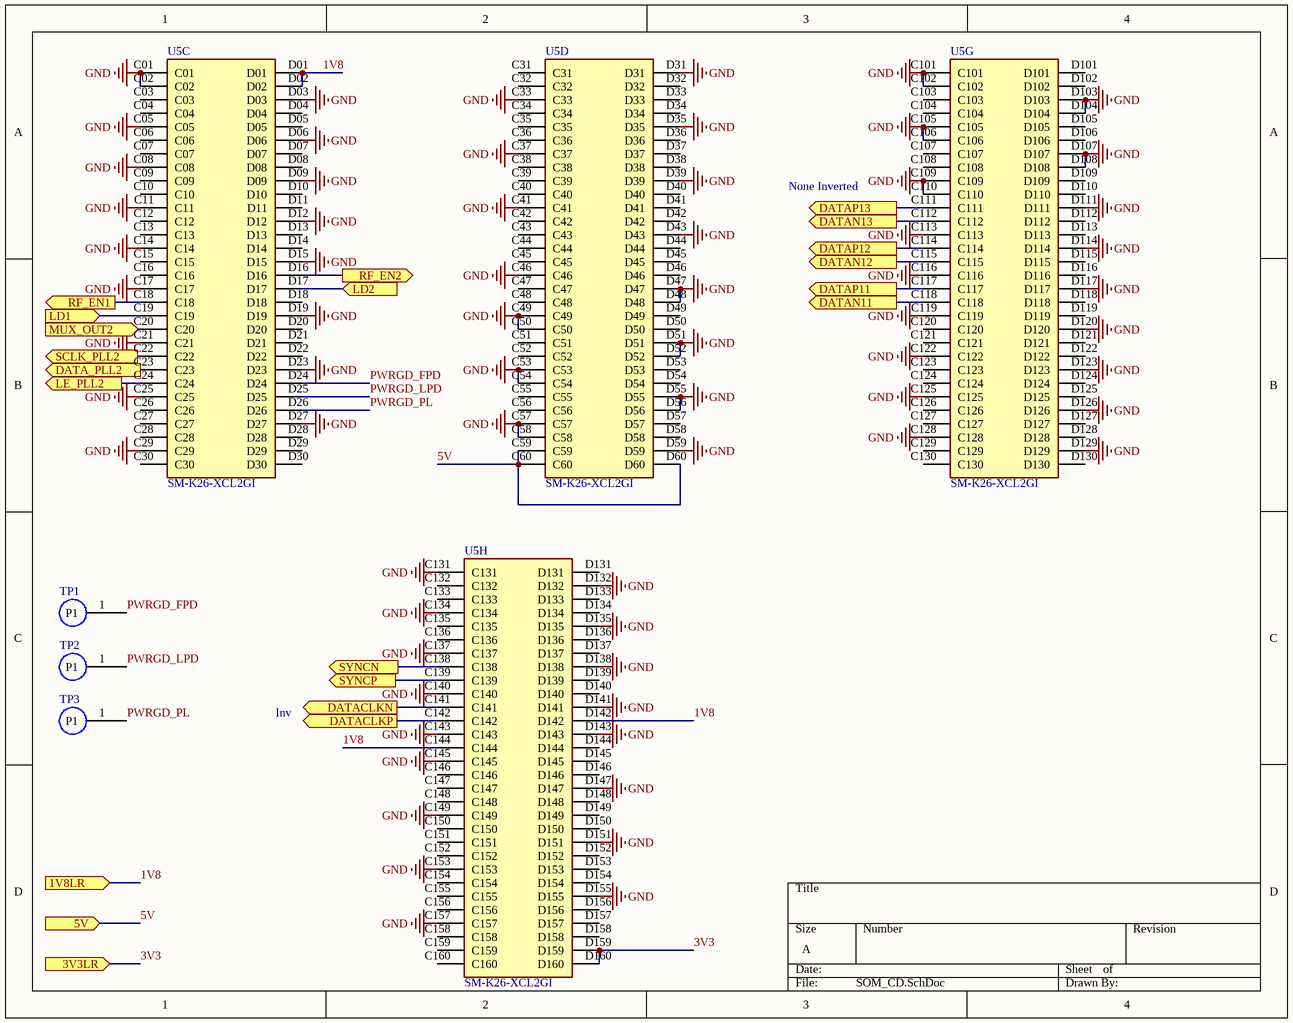
[diagram p6: SOM_CD.SchDoc]

### Parts
TP1  (no value)  [Testpoint]  (no BOM)
TP2  (no value)  [Testpoint]  (no BOM)
TP3  (no value)  [Testpoint]  (no BOM)
U5  SM-K26-XCL2GI  [MODULE_SM-K26-XCL2GI]  (parts C,D,G,H of 8)

### Ports
1V8LR (in), 3V3LR (in), 5V (in), DATA_PLL2 (out), DATACLKN (out), DATACLKP (out), DATAN11 (out), DATAN12 (out), DATAN13 (out), DATAP11 (out), DATAP12 (out), DATAP13 (out), LD1 (in), LD2 (in), LE_PLL2 (out), MUX_OUT2 (in), RF_EN1 (out), RF_EN2 (out), SCLK_PLL2 (out), SYNCN (out), SYNCP (out)

### Nets
GND: U5.C01 U5.C02 U5.C05 U5.C08 U5.C11 U5.C14 U5.C17 U5.C21 U5.C25 U5.C29 U5.C33 U5.C37 U5.C41 U5.C46 U5.C49 U5.C50 U5.C53 U5.C54 U5.C57 U5.C58 U5.C101 U5.C102 U5.C105 U5.C106 U5.C109 U5.C110 U5.C113 U5.C116 U5.C119 U5.C122 U5.C125 U5.C128 U5.C131 U5.C134 U5.C137 U5.C140 U5.C143 U5.C145 U5.C149 U5.C153 U5.C157 U5.D03 U5.D06 U5.D09 U5.D12 U5.D15 U5.D19 U5.D23 U5.D27 U5.D31 U5.D35 U5.D39 U5.D43 U5.D47 U5.D48 U5.D51 U5.D52 U5.D55 U5.D56 U5.D59 U5.D103 U5.D104 U5.D107 U5.D108 U5.D111 U5.D114 U5.D117 U5.D120 U5.D123 U5.D126 U5.D129 U5.D132 U5.D135 U5.D138 U5.D141 U5.D143 U5.D147 U5.D151 U5.D155  [project net PS0]
1V8: U5.C144 U5.D01 U5.D02 U5.D142 ; port 1V8LR
3V3: U5.D159 U5.D160 ; port 3V3LR
5V: U5.C59 U5.C60 U5.D60 ; port 5V
DATA11_N: U5.C118 ; port DATAN11
DATA11_P: U5.C117 ; port DATAP11
DATA12_N: U5.C115 ; port DATAN12
DATA12_P: U5.C114 ; port DATAP12
DATA13_N: U5.C112 ; port DATAN13
DATA13_P: U5.C111 ; port DATAP13
DATA_PLL2: U5.C23 ; port DATA_PLL2
DATACLK_N: U5.C141 ; port DATACLKN
DATACLK_P: U5.C142 ; port DATACLKP
LD1: U5.C19 ; port LD1
LD2: U5.D17 ; port LD2
LE_PLL2: U5.C24 ; port LE_PLL2
MUX_OUT2: U5.C20 ; port MUX_OUT2
PWRGD_FPD: TP1.1(P1) U5.D24
PWRGD_LPD: TP2.1(P1) U5.D25
PWRGD_PL: TP3.1(P1) U5.D26
RF_EN1: U5.C18 ; port RF_EN1
RF_EN2: U5.D16 ; port RF_EN2
SCLK_PLL2: U5.C22 ; port SCLK_PLL2
SYNC_N: U5.C138 ; port SYNCN
SYNC_P: U5.C139 ; port SYNCP

Not connected (* = marked no-connect by the designer): U5 C03 C04 C06 C07 C09 C10 C12 C13 C15 C16 C26 C27 C28 C30 C31 C32 C34 C35 C36 C38 C39 C40 C42 C43 C44 C45 C47 C48 C51 C52 C55 C56 C103 C104 C107 C108 C120 C121 C123 C124 C126 C127 C129 C130 C132 C133 C135 C136 C146 C147 C148 C150 C151 C152 C154 C155 C156 C158 C159 C160 D04 D05 D07 D08 D10 D11 D13 D14 D18 D20 D21 D22 D28 D29 D30 D32 D33 D34 D36 D37 D38 D40 D41 D42 D44 D45 D46 D49 D50 D53 D54 D57 D58 D101 D102 D105 D106 D109 D110 D112 D113 D115 D116 D118 D119 D121 D122 D124 D125 D127 D128 D130 D131 D133 D134 D136 D137 D139 D140 D144 D145 D146 D148 D149 D150 D152 D153 D154 D156 D157 D158

### Notes on the sheet
- None Inverted
- Inv

### Library data of the parts
TP1-TP3 = Testpoint
U5 = SM-K26-XCL2GI: as U5 on sheet SOM_AB; Package: None; SnapEDA_Link: https://www.snapeda.com/parts/SM-K26-XCL2GI/Xilinx+Inc./view-part/?ref=snap; Value: *; MP: SM-K26-XCL2GI; Check_prices: https://www.snapeda.com/parts/SM-K26-XCL2GI/Xilinx+Inc./view-part/?ref=eda; Availability: In Stock; Price: None; Purchase-URL: https://pricing.snapeda.com/search/part/SM-K26-XCL2GI/?ref=eda

## Sheet Clock_Source.SchDoc
size A; SheetNumber: 8; SheetTotal: 9
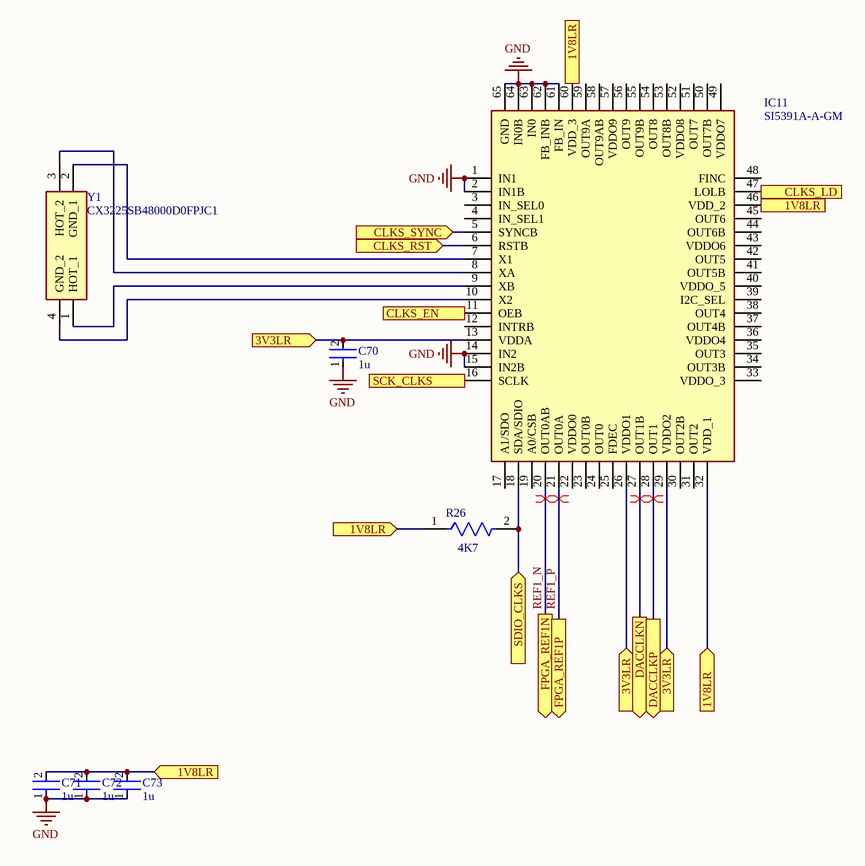
[diagram p7: Clock_Source.SchDoc]

### Parts
C70  1u  [FP-GRM155-0_1-MFG]
C71  1u  [FP-GRM155-0_1-MFG]
C72  1u  [FP-GRM155-0_1-MFG]
C73  1u  [FP-GRM155-0_1-MFG]
IC11  SI5391A-A-GM  [QFN50P900X900X90-65N-D]
R26  4K7  [FP-RT0402-MFG]
Y1  CX3225SB48000D0FPJC1  [CX3225SA40000D0PSVC1]

### Ports
1V8LR (in), 3V3LR (in), CLKS_EN (in), CLKS_LD (out), CLKS_RST (in), CLKS_SYNC (in), DACCLKN (out), DACCLKP (out), FPGA_REF1N (out), FPGA_REF1P (out), SCK_CLKS (in), SDIO_CLKS (in)

### Nets
GND: C70.1 C71.1 C72.1 C73.1 IC11.1(IN1) IC11.2(IN1B) IC11.14(IN2) IC11.15(IN2B) IC11.61(FB_IN) IC11.62(FB_INB) IC11.63(IN0) IC11.64(IN0B) IC11.65(GND)  [project net PS0]
1V8: C71.2 C72.2 C73.2 IC11.32(VDD_1) IC11.46(VDD_2) IC11.60(VDD_3) R26.1 ; port 1V8LR
3V3: C70.2 IC11.13(VDDA) IC11.26(VDDO1) IC11.29(VDDO2) ; port 3V3LR
CLKS_EN: IC11.11(OEB) ; port CLKS_EN
CLKS_LD: IC11.47(LOLB) ; port CLKS_LD
CLKS_RST: IC11.6(RSTB) ; port CLKS_RST
CLKS_SYNC: IC11.5(SYNCB) ; port CLKS_SYNC
DACCLK_N: IC11.27(OUT1B) ; port DACCLKN
DACCLK_P: IC11.28(OUT1) ; port DACCLKP
REF1_N: IC11.20(OUT0AB) ; port FPGA_REF1N
REF1_P: IC11.21(OUT0A) ; port FPGA_REF1P
SCK_CLKS: IC11.16(SCLK) ; port SCK_CLKS
SDIO_CLKS: IC11.18(SDA/SDIO) R26.2 ; port SDIO_CLKS
NetIC11_7: IC11.7(X1) Y1.2(GND_1)
NetIC11_8: IC11.8(XA) Y1.3(HOT_2)
NetIC11_9: IC11.9(XB) Y1.1(HOT_1)
NetIC11_10: IC11.10(X2) Y1.4(GND_2)

Not connected (* = marked no-connect by the designer): IC11 3(IN_SEL0) 4(IN_SEL1) 12(INTRB) 17(A1/SDO) 19(A0/CSB) 22(VDDO0) 23(OUT0B) 24(OUT0) 25(FDEC) 30(OUT2B) 31(OUT2) 33(VDDO_3) 34(OUT3B) 35(OUT3) 36(VDDO4) 37(OUT4B) 38(OUT4) 39(I2C_SEL) 40(VDDO_5) 41(OUT5B) 42(OUT5) 43(VDDO6) 44(OUT6B) 45(OUT6) 48(FINC) 49(VDDO7) 50(OUT7B) 51(OUT7) 52(VDDO8) 53(OUT8B) 54(OUT8) 55(OUT9B) 56(OUT9) 57(VDDO9) 58(OUT9AB) 59(OUT9A)

### Layout directives
differential pair: DACCLK_N, DACCLK_P, REF1_N, REF1_P

### Library data of the parts
C70-C73 = CMP-06035-041084-1: as C1 on sheet Power
IC11 = SI5391A-A-GM: Integrated Circuit; Manufacturer_Name: Skyworks; Datasheet Link: https://www.skyworksinc.com/-/media/Skyworks/SL/documents/public/data-sheets/si5391-datasheet.pdf; Height: 0.9mm; Manufacturer_Part_Number: SI5391A-A-GM
R26 = CMP-2002-02901-2: as R12 on sheet DACs; ComponentLink2URL: http://www.yageo.com/documents/recent/PYu-RT_1-to-0.01_RoHS_L_9.pdf; Temperature Range High: +155°C; Mouser Description: Res Thin Film 0402 4.7K Ohm 1% 1/16W ±50ppm/°C SMD Paper T/R; Temperature Range Low: -55°C; Device Class L1: Passive Components; Lead Free: Yes; Series: RT; Resistance: 4.7KΩ; Automotive: No; Package: RT0402; Composition: Thin Film; RoHS: TRUE; ComponentLink2Description: Datasheet; Octopart: https://octopart.com/rt0402fre074k7l-yageo-1371922; Footprint Url: http://www.yageo.com/exep/pages/download/literatures/PYu-R_Mount_10.pdf; Height: 0.35mm; Category: Res; Device Class L3: Chip SMD Resistors; Temperature: -55°C to +155°C; Digikey Description: RES 4.70K OHM 1/16W 1% SMD 0402; Device Class L2: Resistors; Ipc Land Pattern Name: RESC10050X30
Y1 = CX3225SA40000D0PSVC1: Crystal or Oscillator; Manufacturer_Name: KYOCERA; Datasheet Link: https://www.mouser.cn/datasheet/2/40/Kyocera_03282023_Mouser_CX3225SA40000D0PSVC1_UKY1C-3134464.pdf; Height: 0.8mm; Manufacturer_Part_Number: CX3225SA40000D0PSVC1; Mouser Part Number: 581-CX3225SA40DPSVC1; Mouser Price/Stock: https://www.mouser.co.uk/ProductDetail/KYOCERA-AVX/CX3225SA40000D0PSVC1?qs=9vOqFld9vZW3kz2Es9bwkA%3D%3D

## Sheet Connectors.SchDoc
size A; SheetNumber: 9; SheetTotal: 9
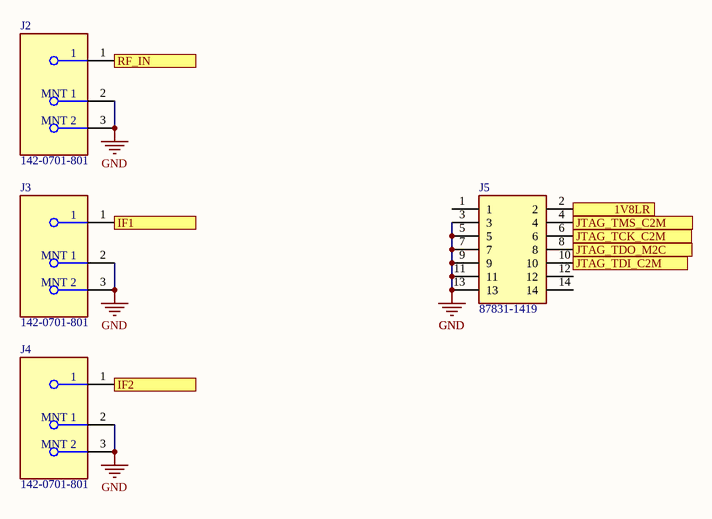
[diagram p8: Connectors.SchDoc]

### Parts
J2  142-0701-801  [FP-142-0701-801-MFG]
J3  142-0701-801  [FP-142-0701-801-MFG]
J4  142-0701-801  [FP-142-0701-801-MFG]
J5  87831-1419  [SHDR14W55P200_2X7_1665X630X640P]

### Ports
1V8LR (in), IF1 (in), IF2 (in), JTAG_TCK_C2M (out), JTAG_TDI_C2M (out), JTAG_TDO_M2C (in), JTAG_TMS_C2M (out), RF_IN (out)

### Nets
GND: J2.2(MNT_1) J2.3(MNT_2) J3.2(MNT_1) J3.3(MNT_2) J4.2(MNT_1) J4.3(MNT_2) J5.3 J5.5 J5.7 J5.9 J5.11 J5.13  [project net PS0]
1V8: J5.2 ; port 1V8LR
IF1: J3.1 ; port IF1
IF2: J4.1 ; port IF2
JTAG_TCK_C2M: J5.6 ; port JTAG_TCK_C2M
JTAG_TDI_C2M: J5.10 ; port JTAG_TDI_C2M
JTAG_TDO_M2C: J5.8 ; port JTAG_TDO_M2C
JTAG_TMS_C2M: J5.4 ; port JTAG_TMS_C2M
RF_IN: J2.1 ; port RF_IN

Not connected (* = marked no-connect by the designer): J5 1 12 14

### Library data of the parts
J2-J4 = CMP-09588-000002-1: CONN SMA JACK STR 50OHM EDGE MNT; Frequency: 18GHz; Operating Frequency: 0 to 18 GHz; Body Material: Brass; Impedance: 50R; Voltage Rating: 335V; Gender: Female; Body Plating: Gold; Orientation: Straight; Length: 0.44inch; Max Operating Temperature: 165°C; Package Quantity: 5; Packaging: Bulk; Series: SMA; Contact Material: Copper; Min Operating Temperature: -65°C; Depth: 25.58mm; RoHS Compliant: Yes; Case/Package: SMA; Max Frequency: 18GHz; Radiation Hardening: No; Contact Plating: Gold; Mount: Edge; Connector Type: SMA; Fastening Type: Threaded; Termination: Solder
J5 = 87831-1419: Connector; Manufacturer_Name: Molex; Datasheet Link: https://componentsearchengine.com/Datasheets/1/87831-1419.pdf; Height: 6.4mm; Manufacturer_Part_Number: 87831-1419; Mouser Part Number: 538-87831-1419; Mouser Price/Stock: https://www.mouser.co.uk/ProductDetail/Molex/87831-1419?qs=6BVwEky2YVwe7CvCRRAl0Q%3D%3D

## Nets that join several sheets
PS0: Power (31 pins), Mixers (40 pins), DACs (33 pins), PLL1 (28 pins), PLL2 (28 pins), SOM_AB (87 pins), SOM_CD (79 pins), Clock_Source (13 pins), Connectors (12 pins)
1V8: Power (C13.2 IC2.1 IC2.2), DACs (15 pins), SOM_AB (U5.A144 U5.B142 U5.B159 U5.B160), SOM_CD (U5.C144 U5.D01 U5.D02 U5.D142), Clock_Source (7 pins), Connectors (J5.2)
3V3: Power (C2.1 U1.1 U1.2), DACs (7 pins), PLL1 (15 pins), PLL2 (15 pins), SOM_AB (U5.B13 U5.B14), SOM_CD (U5.D159 U5.D160), Clock_Source (C70.2 IC11.13 IC11.26 IC11.29)
5V: Power (9 pins), SOM_AB (U5.A59 U5.A60 U5.B60), SOM_CD (U5.C59 U5.C60 U5.D60)
5VLR: Power (C5.1 U2.1 U2.2), Mixers (IC4.4 IC7.4)
ALARM: DACs (U4.47), SOM_AB (U5.B17)
CLKS_EN: SOM_AB (U5.A152), Clock_Source (IC11.11)
CLKS_LD: SOM_AB (U5.A148), Clock_Source (IC11.47)
CLKS_RST: SOM_AB (U5.A150), Clock_Source (IC11.6)
CLKS_SYNC: SOM_AB (U5.A151), Clock_Source (IC11.5)
DACCLK_N: DACs (C23.2), Clock_Source (IC11.27)
DACCLK_P: DACs (C22.2), Clock_Source (IC11.28)
DATA0_N: DACs (U4.40), SOM_AB (U5.A111)
DATA0_P: DACs (U4.39), SOM_AB (U5.A112)
DATA1_N: DACs (U4.38), SOM_AB (U5.A114)
DATA1_P: DACs (U4.37), SOM_AB (U5.A115)
DATA2_N: DACs (U4.36), SOM_AB (U5.A117)
DATA2_P: DACs (U4.35), SOM_AB (U5.A118)
DATA3_N: DACs (U4.34), SOM_AB (U5.A120)
DATA3_P: DACs (U4.33), SOM_AB (U5.A121)
DATA4_N: DACs (U4.32), SOM_AB (U5.A123)
DATA4_P: DACs (U4.31), SOM_AB (U5.A124)
DATA5_N: DACs (U4.30), SOM_AB (U5.A126)
DATA5_P: DACs (U4.29), SOM_AB (U5.A127)
DATA6_N: DACs (U4.27), SOM_AB (U5.B112)
DATA6_P: DACs (U4.26), SOM_AB (U5.B113)
DATA7_N: DACs (U4.23), SOM_AB (U5.B115)
DATA7_P: DACs (U4.22), SOM_AB (U5.B116)
DATA8_N: DACs (U4.20), SOM_AB (U5.B118)
DATA8_P: DACs (U4.19), SOM_AB (U5.B119)
DATA9_N: DACs (U4.18), SOM_AB (U5.B121)
DATA9_P: DACs (U4.17), SOM_AB (U5.B122)
DATA10_N: DACs (U4.16), SOM_AB (U5.B124)
DATA10_P: DACs (U4.15), SOM_AB (U5.B125)
DATA11_N: DACs (U4.14), SOM_CD (U5.C118)
DATA11_P: DACs (U4.13), SOM_CD (U5.C117)
DATA12_N: DACs (U4.12), SOM_CD (U5.C115)
DATA12_P: DACs (U4.11), SOM_CD (U5.C114)
DATA13_N: DACs (U4.10), SOM_CD (U5.C112)
DATA13_P: DACs (U4.9), SOM_CD (U5.C111)
DATA_PLL1: PLL1 (IC9.2), SOM_AB (U5.B21)
DATA_PLL2: PLL2 (IC10.2), SOM_CD (U5.C23)
DATACLK_N: DACs (U4.25), SOM_CD (U5.C141)
DATACLK_P: DACs (U4.24), SOM_CD (U5.C142)
EN: Power (IC2.4 U1.4 U2.4), SOM_AB (U5.A20)
IF1: Mixers (IC3.3), Connectors (J3.1)
IF2: Mixers (IC6.3), Connectors (J4.1)
JTAG_TCK_C2M: SOM_AB (U5.A25), Connectors (J5.6)
JTAG_TDI_C2M: SOM_AB (U5.A24), Connectors (J5.10)
JTAG_TDO_M2C: SOM_AB (U5.A23), Connectors (J5.8)
JTAG_TMS_C2M: SOM_AB (U5.A22), Connectors (J5.4)
LD1: PLL1 (IC9.25), SOM_CD (U5.C19)
LD2: PLL2 (IC10.25), SOM_CD (U5.D17)
LE_PLL1: PLL1 (IC9.3), SOM_AB (U5.B22)
LE_PLL2: PLL2 (IC10.3), SOM_CD (U5.C24)
LO1: Mixers (C16.2), PLL1 (T3.6)
LO2: Mixers (C17.2), PLL2 (T4.6)
MUX_OUT1: PLL1 (IC9.30), SOM_AB (U5.B18)
MUX_OUT2: PLL2 (IC10.30), SOM_CD (U5.C20)
REF1: DACs (C19.2 L2.2 R5.2), PLL1 (C36.2)
REF1_N: SOM_AB (U5.A06), Clock_Source (IC11.20)
REF1_P: SOM_AB (U5.A07), Clock_Source (IC11.21)
REF2: DACs (C21.2 L3.2 R9.2), PLL2 (C53.2)
RESETB_DAC: DACs (U4.41), SOM_AB (U5.B16)
RF_EN1: PLL1 (IC9.26), SOM_CD (U5.C18)
RF_EN2: PLL2 (IC10.26), SOM_CD (U5.D16)
RF_IN: Mixers (U3.21), Connectors (J2.1)
SCK_CLKS: SOM_AB (U5.A146), Clock_Source (IC11.16)
SCLK_DAC: DACs (U4.43), SOM_AB (U5.A16)
SCLK_PLL1: PLL1 (IC9.1), SOM_AB (U5.B20)
SCLK_PLL2: PLL2 (IC10.1), SOM_CD (U5.C22)
SDIO_CLKS: SOM_AB (U5.A147), Clock_Source (IC11.18 R26.2)
SDIO_DAC: DACs (U4.44), SOM_AB (U5.A15)
SYNC_N: DACs (U4.7), SOM_CD (U5.C138)
SYNC_P: DACs (U4.6), SOM_CD (U5.C139)
TXENABLE: DACs (R12.1 U4.48), SOM_AB (U5.A17)